# EAGLE design StearnsW (EAGLE 6.6.0)
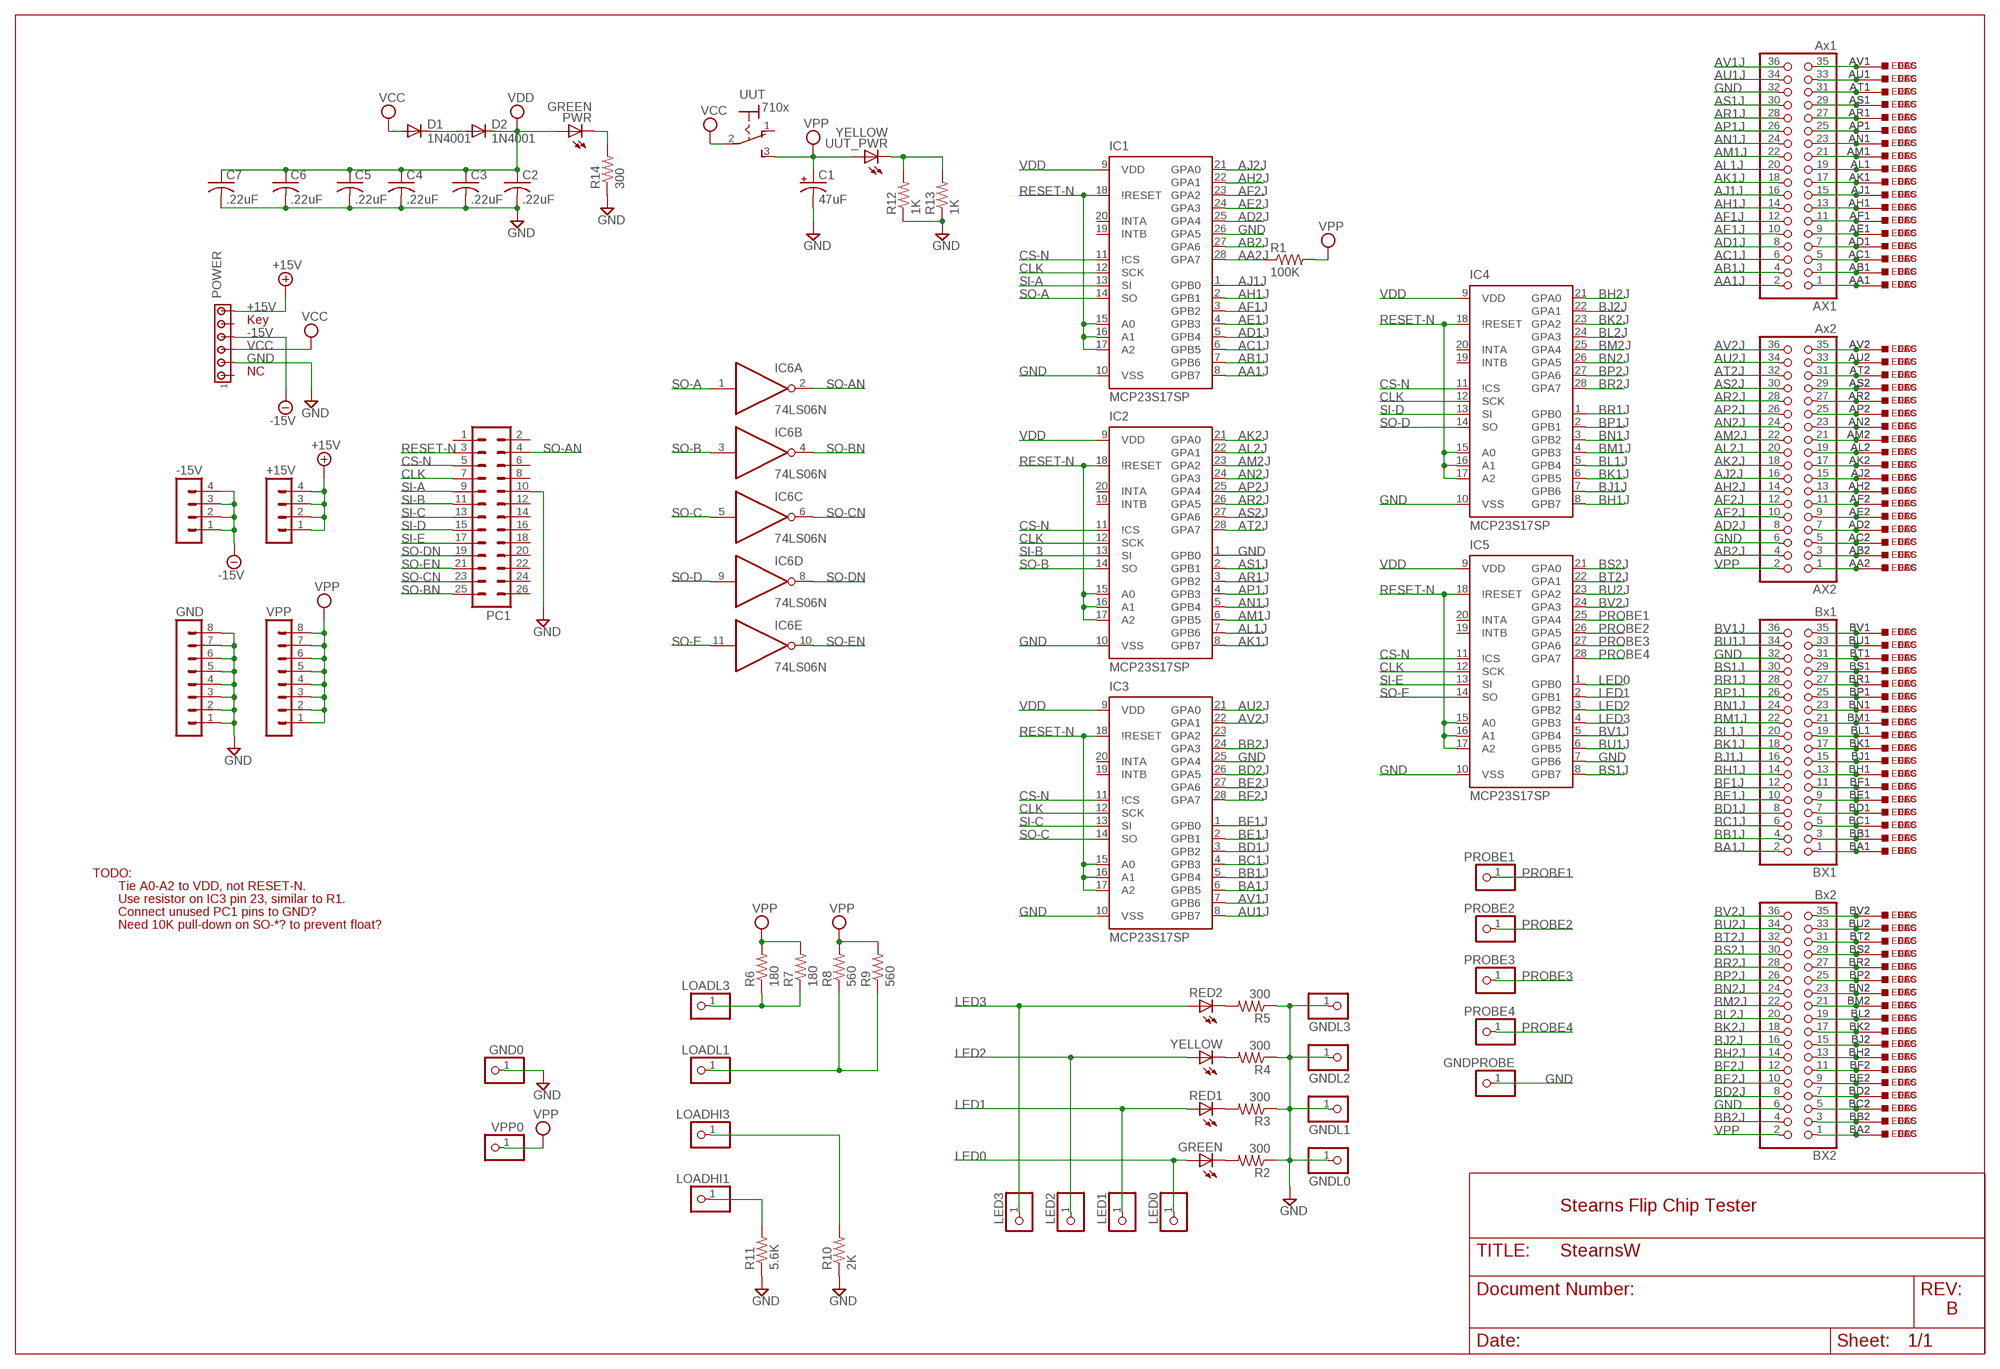
[diagram p0: schematic, sheet 1]

## Parts
+15V  MA04-1  [MA04-1]
-15V  MA04-1  [MA04-1]
AX1  Ax1  PINHD-2X18  [2X18]
AX2  Ax2  PINHD-2X18  [2X18]
BX1  Bx1  PINHD-2X18  [2X18]
BX2  Bx2  PINHD-2X18  [2X18]
C1  47uF  CPOL-USE5-8.5  [E5-8,5]
C2  .22uF  C-US050-025X075  [C050-025X075]
C3  .22uF  C-US050-025X075  [C050-025X075]
C4  .22uF  C-US050-025X075  [C050-025X075]
C5  .22uF  C-US050-025X075  [C050-025X075]
C6  .22uF  C-US050-025X075  [C050-025X075]
C7  .22uF  C-US050-025X075  [C050-025X075]
D1  1N4001  1N4004  [DO41-10]
D2  1N4001  1N4004  [DO41-10]
DEC  W971  [H807-2]
ECS  W971ECS  [ECS2418-2]
EDAC  W971EDAC  [EDAC346-36-2]
GND  MA08-1  [MA08-1]
GND0  PINHD-1X1  [1X01]
GNDL0  PINHD-1X1  [1X01]
GNDL1  PINHD-1X1  [1X01]
GNDL2  PINHD-1X1  [1X01]
GNDL3  PINHD-1X1  [1X01]
GNDPROBE  PINHD-1X1  [1X01]
GREEN  LED5MM  [LED5MM]
IC1  MCP23S17SP  [DIL28-3]
IC2  MCP23S17SP  [DIL28-3]
IC3  MCP23S17SP  [DIL28-3]
IC4  MCP23S17SP  [DIL28-3]
IC5  MCP23S17SP  [DIL28-3]
IC6  74LS06N  [DIL14]
LED0  PINHD-1X1  [1X01]
LED1  PINHD-1X1  [1X01]
LED2  PINHD-1X1  [1X01]
LED3  PINHD-1X1  [1X01]
LOADHI1  PINHD-1X1  [1X01]
LOADHI3  PINHD-1X1  [1X01]
LOADL1  PINHD-1X1  [1X01]
LOADL3  PINHD-1X1  [1X01]
PC1  MA13-2  [MA13-2]
POWER  MTA06-156  [1X6MTA]
PROBE1  PINHD-1X1  [1X01]
PROBE2  PINHD-1X1  [1X01]
PROBE3  PINHD-1X1  [1X01]
PROBE4  PINHD-1X1  [1X01]
PWR  GREEN  LED5MM  [LED5MM]
R1  100K  R-US_0207/10  [0207/10]
R2  300  R-US_0207/10  [0207/10]
R3  300  R-US_0207/10  [0207/10]
R4  300  R-US_0207/10  [0207/10]
R5  300  R-US_0207/10  [0207/10]
R6  180  R-US_0207/10  [0207/10]
R7  180  R-US_0207/10  [0207/10]
R8  560  R-US_0207/10  [0207/10]
R9  560  R-US_0207/10  [0207/10]
R10  2K  R-US_0207/10  [0207/10]
R11  5.6K  R-US_0207/10  [0207/10]
R12  1K  R-US_0207/10  [0207/10]
R13  1K  R-US_0207/10  [0207/10]
R14  300  R-US_0207/10  [0207/10]
RED1  LED5MM  [LED5MM]
RED2  LED5MM  [LED5MM]
UUT  710x  710X  [7109MD9V3]
UUT_PWR  YELLOW  LED5MM  [LED5MM]
VPP  MA08-1  [MA08-1]
VPP0  PINHD-1X1  [1X01]
YELLOW  LED5MM  [LED5MM]

## Nets
+15V [Supply]: +15V.1 +15V.2 +15V.3 +15V.4 POWER.6
-15V [Supply]: -15V.1 -15V.2 -15V.3 -15V.4 POWER.4
AA1J: AX1.2 IC1.8(GPB7)
AA2J: IC1.28(GPA7) R1.1
AB1J: AX1.4 IC1.7(GPB6)
AB2J: AX2.4 IC1.27(GPA6)
AC1J: AX1.6 IC1.6(GPB5)
AD1J: AX1.8 IC1.5(GPB4)
AD2J: AX2.8 IC1.25(GPA4)
AE1J: AX1.10 IC1.4(GPB3)
AE2J: AX2.10 IC1.24(GPA3)
AF1J: AX1.12 IC1.3(GPB2)
AF2J: AX2.12 IC1.23(GPA2)
AH1J: AX1.14 IC1.2(GPB1)
AH2J: AX2.14 IC1.22(GPA1)
AJ1J: AX1.16 IC1.1(GPB0)
AJ2J: AX2.16 IC1.21(GPA0)
AK1J: AX1.18 IC2.8(GPB7)
AK2J: AX2.18 IC2.21(GPA0)
AL1J: AX1.20 IC2.7(GPB6)
AL2J: AX2.20 IC2.22(GPA1)
AM1J: AX1.22 IC2.6(GPB5)
AM2J: AX2.22 IC2.23(GPA2)
AN1J: AX1.24 IC2.5(GPB4)
AN2J: AX2.24 IC2.24(GPA3)
AP1J: AX1.26 IC2.4(GPB3)
AP2J: AX2.26 IC2.25(GPA4)
AR1J: AX1.28 IC2.3(GPB2)
AR2J: AX2.28 IC2.26(GPA5)
AS1J: AX1.30 IC2.2(GPB1)
AS2J: AX2.30 IC2.27(GPA6)
AT2J: AX2.32 IC2.28(GPA7)
AU1J: AX1.34 IC3.8(GPB7)
AU2J: AX2.34 IC3.21(GPA0)
AV1J: AX1.36 IC3.7(GPB6)
AV2J: AX2.36 IC3.22(GPA1)
BA1J: BX1.2 IC3.6(GPB5)
BB1J: BX1.4 IC3.5(GPB4)
BB2J: BX2.4 IC3.24(GPA3)
BC1J: BX1.6 IC3.4(GPB3)
BD1J: BX1.8 IC3.3(GPB2)
BD2J: BX2.8 IC3.26(GPA5)
BE1J: BX1.10 IC3.2(GPB1)
BE2J: BX2.10 IC3.27(GPA6)
BF1J: BX1.12 IC3.1(GPB0)
BF2J: BX2.12 IC3.28(GPA7)
BH1J: BX1.14 IC4.8(GPB7)
BH2J: BX2.14 IC4.21(GPA0)
BJ1J: BX1.16 IC4.7(GPB6)
BJ2J: BX2.16 IC4.22(GPA1)
BK1J: BX1.18 IC4.6(GPB5)
BK2J: BX2.18 IC4.23(GPA2)
BL1J: BX1.20 IC4.5(GPB4)
BL2J: BX2.20 IC4.24(GPA3)
BM1J: BX1.22 IC4.4(GPB3)
BM2J: BX2.22 IC4.25(GPA4)
BN1J: BX1.24 IC4.3(GPB2)
BN2J: BX2.24 IC4.26(GPA5)
BP1J: BX1.26 IC4.2(GPB1)
BP2J: BX2.26 IC4.27(GPA6)
BR1J: BX1.28 IC4.1(GPB0)
BR2J: BX2.28 IC4.28(GPA7)
BS1J: BX1.30 IC5.8(GPB7)
BS2J: BX2.30 IC5.21(GPA0)
BT2J: BX2.32 IC5.22(GPA1)
BU1J: BX1.34 IC5.6(GPB5)
BU2J: BX2.34 IC5.23(GPA2)
BV1J: BX1.36 IC5.5(GPB4)
BV2J: BX2.36 IC5.24(GPA3)
CLK: IC1.12(SCK) IC2.12(SCK) IC3.12(SCK) IC4.12(SCK) IC5.12(SCK) PC1.7
CS-N: IC1.11(\!CS) IC2.11(\!CS) IC3.11(\!CS) IC4.11(\!CS) IC5.11(\!CS) PC1.5
GND [Supply]: AX1.32 AX2.6 BX1.32 BX2.6 C1.- C2.2 C3.2 C4.2 C5.2 C6.2 C7.2 GND0.1 GND.1 GND.2 GND.3 GND.4 GND.5 GND.6 GND.7 GND.8 GNDL0.1 GNDL1.1 GNDL2.1 GNDL3.1 GNDPROBE.1 IC1.10(VSS) IC1.26(GPA5) IC2.1(GPB0) IC2.10(VSS) IC3.10(VSS) IC3.25(GPA4) IC4.10(VSS) IC5.7(GPB6) IC5.10(VSS) PC1.10 POWER.2 R2.1 R3.1 R4.1 R5.1 R10.1 R11.1 R12.1 R13.1 R14.1
LED0: GREEN.A IC5.1(GPB0) LED0.1
LED1: IC5.2(GPB1) LED1.1 RED1.A
LED2: IC5.3(GPB2) LED2.1 YELLOW.A
LED3: IC5.4(GPB3) LED3.1 RED2.A
N$1: AX1.1 DEC.AA1 ECS.AA1 EDAC.AA1
N$2: AX1.35 DEC.AV1 ECS.AV1 EDAC.AV1
N$3: AX1.33 DEC.AU1 ECS.AU1 EDAC.AU1
N$4: AX1.31 DEC.AT1 ECS.AT1 EDAC.AT1
N$5: AX1.29 DEC.AS1 ECS.AS1 EDAC.AS1
N$6: AX1.27 DEC.AR1 ECS.AR1 EDAC.AR1
N$7: AX1.25 DEC.AP1 ECS.AP1 EDAC.AP1
N$8: AX1.23 DEC.AN1 ECS.AN1 EDAC.AN1
N$9: AX1.21 DEC.AM1 ECS.AM1 EDAC.AM1
N$10: AX1.19 DEC.AL1 ECS.AL1 EDAC.AL1
N$11: AX1.17 DEC.AK1 ECS.AK1 EDAC.AK1
N$12: AX1.15 DEC.AJ1 ECS.AJ1 EDAC.AJ1
N$13: AX1.13 DEC.AH1 ECS.AH1 EDAC.AH1
N$14: AX1.11 DEC.AF1 ECS.AF1 EDAC.AF1
N$15: AX1.9 DEC.AE1 ECS.AE1 EDAC.AE1
N$16: AX1.7 DEC.AD1 ECS.AD1 EDAC.AD1
N$17: AX1.5 DEC.AC1 ECS.AC1 EDAC.AC1
N$18: AX1.3 DEC.AB1 ECS.AB1 EDAC.AB1
N$19: AX2.1 DEC.AA2 ECS.AA2 EDAC.AA2
N$20: AX2.3 DEC.AB2 ECS.AB2 EDAC.AB2
N$21: AX2.5 DEC.AC2 ECS.AC2 EDAC.AC2
N$22: AX2.7 DEC.AD2 ECS.AD2 EDAC.AD2
N$23: AX2.9 DEC.AE2 ECS.AE2 EDAC.AE2
N$24: AX2.11 DEC.AF2 ECS.AF2 EDAC.AF2
N$25: AX2.13 DEC.AH2 ECS.AH2 EDAC.AH2
N$26: AX2.15 DEC.AJ2 ECS.AJ2 EDAC.AJ2
N$27: AX2.17 DEC.AK2 ECS.AK2 EDAC.AK2
N$28: AX2.19 DEC.AL2 ECS.AL2 EDAC.AL2
N$29: AX2.21 DEC.AM2 ECS.AM2 EDAC.AM2
N$30: AX2.23 DEC.AN2 ECS.AN2 EDAC.AN2
N$31: AX2.25 DEC.AP2 ECS.AP2 EDAC.AP2
N$32: AX2.27 DEC.AR2 ECS.AR2 EDAC.AR2
N$33: AX2.29 DEC.AS2 ECS.AS2 EDAC.AS2
N$34: AX2.31 DEC.AT2 ECS.AT2 EDAC.AT2
N$35: AX2.33 DEC.AU2 ECS.AU2 EDAC.AU2
N$36: AX2.35 DEC.AV2 ECS.AV2 EDAC.AV2
N$37: BX2.1 DEC.BA2 ECS.BA2 EDAC.BA2
N$38: BX2.3 DEC.BB2 ECS.BB2 EDAC.BB2
N$39: BX2.5 DEC.BC2 ECS.BC2 EDAC.BC2
N$40: BX2.7 DEC.BD2 ECS.BD2 EDAC.BD2
N$41: BX2.9 DEC.BE2 ECS.BE2 EDAC.BE2
N$42: BX2.11 DEC.BF2 ECS.BF2 EDAC.BF2
N$43: BX2.13 DEC.BH2 ECS.BH2 EDAC.BH2
N$44: BX2.15 DEC.BJ2 ECS.BJ2 EDAC.BJ2
N$45: BX2.17 DEC.BK2 ECS.BK2 EDAC.BK2
N$46: BX2.19 DEC.BL2 ECS.BL2 EDAC.BL2
N$47: BX2.21 DEC.BM2 ECS.BM2 EDAC.BM2
N$48: BX2.23 DEC.BN2 ECS.BN2 EDAC.BN2
N$49: BX2.25 DEC.BP2 ECS.BP2 EDAC.BP2
N$50: BX2.27 DEC.BR2 ECS.BR2 EDAC.BR2
N$51: BX2.29 DEC.BS2 ECS.BS2 EDAC.BS2
N$52: BX2.31 DEC.BT2 ECS.BT2 EDAC.BT2
N$53: BX2.33 DEC.BU2 ECS.BU2 EDAC.BU2
N$54: BX2.35 DEC.BV2 ECS.BV2 EDAC.BV2
N$55: BX1.1 DEC.BA1 ECS.BA1 EDAC.BA1
N$56: BX1.3 DEC.BB1 ECS.BB1 EDAC.BB1
N$57: BX1.5 DEC.BC1 ECS.BC1 EDAC.BC1
N$58: BX1.7 DEC.BD1 ECS.BD1 EDAC.BD1
N$59: BX1.9 DEC.BE1 ECS.BE1 EDAC.BE1
N$60: BX1.11 DEC.BF1 ECS.BF1 EDAC.BF1
N$61: BX1.13 DEC.BH1 ECS.BH1 EDAC.BH1
N$62: BX1.15 DEC.BJ1 ECS.BJ1 EDAC.BJ1
N$63: BX1.17 DEC.BK1 ECS.BK1 EDAC.BK1
N$64: BX1.19 DEC.BL1 ECS.BL1 EDAC.BL1
N$65: BX1.21 DEC.BM1 ECS.BM1 EDAC.BM1
N$66: BX1.23 DEC.BN1 ECS.BN1 EDAC.BN1
N$67: BX1.25 DEC.BP1 ECS.BP1 EDAC.BP1
N$68: BX1.27 DEC.BR1 ECS.BR1 EDAC.BR1
N$69: BX1.29 DEC.BS1 ECS.BS1 EDAC.BS1
N$70: BX1.31 DEC.BT1 ECS.BT1 EDAC.BT1
N$71: BX1.33 DEC.BU1 ECS.BU1 EDAC.BU1
N$72: BX1.35 DEC.BV1 ECS.BV1 EDAC.BV1
N$73: GREEN.K(C) R2.2
N$74: R3.2 RED1.K(C)
N$75: R4.2 YELLOW.K(C)
N$76: R5.2 RED2.K(C)
N$77: LOADL3.1 R6.1 R7.1
N$78: LOADL1.1 R8.1 R9.1
N$79: LOADHI1.1 R11.2
N$80: LOADHI3.1 R10.2
N$81: D1.C D2.A
N$82: R12.2 R13.2 UUT_PWR.K(C)
N$83: PWR.K(C) R14.2
PROBE1: IC5.25(GPA4) PROBE1.1
PROBE2: IC5.26(GPA5) PROBE2.1
PROBE3: IC5.27(GPA6) PROBE3.1
PROBE4: IC5.28(GPA7) PROBE4.1
RESET-N: IC1.15(A0) IC1.16(A1) IC1.17(A2) IC1.18(\!RESET) IC2.15(A0) IC2.16(A1) IC2.17(A2) IC2.18(\!RESET) IC3.15(A0) IC3.16(A1) IC3.17(A2) IC3.18(\!RESET) IC4.15(A0) IC4.16(A1) IC4.17(A2) IC4.18(\!RESET) IC5.15(A0) IC5.16(A1) IC5.17(A2) IC5.18(\!RESET) PC1.3
SI-A: IC1.13(SI) PC1.9
SI-B: IC2.13(SI) PC1.11
SI-C: IC3.13(SI) PC1.13
SI-D: IC4.13(SI) PC1.15
SI-E: IC5.13(SI) PC1.17
SO-A: IC1.14(SO) IC6.1(A:I)
SO-AN: IC6.2(A:O) PC1.4
SO-B: IC2.14(SO) IC6.3(B:I)
SO-BN: IC6.4(B:O) PC1.25
SO-C: IC3.14(SO) IC6.5(C:I)
SO-CN: IC6.6(C:O) PC1.23
SO-D: IC4.14(SO) IC6.9(D:I)
SO-DN: IC6.8(D:O) PC1.19
SO-E: IC5.14(SO) IC6.11(E:I)
SO-EN: IC6.10(E:O) PC1.21
VCC [Supply]: D1.A POWER.3 UUT.2(P)
VDD [Supply]: C2.1 C3.1 C4.1 C5.1 C6.1 C7.1 D2.C IC1.9(VDD) IC2.9(VDD) IC3.9(VDD) IC4.9(VDD) IC5.9(VDD) PWR.A
VPP [Supply]: AX2.2 BX2.2 C1.+ R1.2 R6.2 R7.2 R8.2 R9.2 UUT.3(S) UUT_PWR.A VPP0.1 VPP.1 VPP.2 VPP.3 VPP.4 VPP.5 VPP.6 VPP.7 VPP.8
Unconnected: IC1.19(INTB) IC1.20(INTA) IC2.19(INTB) IC2.20(INTA) IC3.19(INTB) IC3.20(INTA) IC3.23(GPA2) IC4.19(INTB) IC4.20(INTA) IC5.19(INTB) IC5.20(INTA) IC6.12(F:O) IC6.13(F:I) PC1.1 PC1.2 PC1.6 PC1.8 PC1.12 PC1.14 PC1.16 PC1.18 PC1.20 PC1.22 PC1.24 PC1.26 POWER.1 POWER.5 UUT.1(O)

## Notes on the sheet
- Key
- NC
- TODO:
- Tie A0-A2 to VDD, not RESET-N.
- Use resistor on IC3 pin 23, similar to R1.
- Connect unused PC1 pins to GND?
- Need 10K pull-down on SO-*? to prevent float?
- Stearns Flip Chip Tester
- B

## Power pins joined to a net without a drawn wire
GND: IC6.7(P:GND) UUT.NC@1(GND) UUT.NC@2(GND) UUT.NC@3(GND) UUT.NC@4(GND) UUT.NC@5(GND) UUT.NC@6(GND) UUT.NC@7(GND) UUT.NC@8(GND)
VCC: IC6.14(P:VCC)

## Library data of the parts
+15V -15V = con-lstb:MA04-1: PIN HEADER; OC_FARNELL: unknown; OC_NEWARK: unknown
AX1 AX2 BX1 BX2 = pinhead:PINHD-2X18: PIN HEADER
C1 = rcl:CPOL-US: POLARIZED CAPACITOR, American symbol
C2-C7 = rcl:C-US: CAPACITOR, American symbol
D1 D2 = diode:1N4004: DIODE general purpose rectifier, 1 A
DEC ECS EDAC = dec-m:W971: Double sided Double Height Connector, 72 pins
GND VPP = con-lstb:MA08-1: PIN HEADER; OC_FARNELL: unknown; OC_NEWARK: unknown
GND0 GNDL0 GNDL1-GNDL3 GNDPROBE LED0 LED1-LED3 LOADHI1 LOADHI3 LOADL1 LOADL3 PROBE1-PROBE4 VPP0 = pinhead:PINHD-1X1: PIN HEADER
GREEN PWR RED1 RED2 UUT_PWR YELLOW = led:LED: LED OSRAM: - CHIPLED LG R971, LG N971, LY N971, LG Q971, LY Q971, LO R971, LY R971 LH N974, LH R974 LS Q976, LO Q976, LY Q976 LO Q996 - Hyper CHIPLED LW Q18S LB Q993, LB Q99A, LB R99A - SideLED LS A670, LO A670, LY A670, LG A670, LP A670 LB A673, LV A673, LT A673, LW A673 LH A674 LY A675 LS A676, LA A676, LO A676, LY A676, LW A676 LS A679, LY A679, LG A679 - Hyper Micro SIDELED® LS Y876, LA Y876, LO Y876, LY Y876 LT Y87S - SmartLED LW L88C, LW L88S LB L89C, LB L89S, LG L890 LS L89K, LO L89K, LY L89K LS L896, LA L896, LO L896, LY L896 - TOPLED LS T670, LO T670, LY T670, LG T670, LP T670 LSG T670, LSP T670, LSY T670, LOP T670, LYG T670 LG T671, LOG T671, LSG T671 LB T673, LV T673, LT T673, LW T673 LH T674 LS T676, LA T676, LO T676, LY T676, LB T676, LH T676, LSB T676, LW T676 LB T67C, LV T67C, LT T67C, LS T67K, LO T67K, LY T67K, LW E67C LS E67B, LA E67B, LO E67B, LY E67B, LB E67C, LV E67C, LT E67C LW T67C LS T679, LY T679, LG T679 LS T770, LO T770, LY T770, LG T770, LP T770 LB T773, LV T773, LT T773, LW T773 LH T774 LS E675, LA E675, LY E675, LS T675 LS T776, LA T776, LO T776, LY T776, LB T776 LHGB T686 LT T68C, LB T68C - Hyper Mini TOPLED® LB M676 - Mini TOPLED Santana® LG M470 LS M47K, LO M47K, LY M47K Source: http://www.osram.convergy.de LUXEON: - LUMILED® LXK2-PW12-R00, LXK2-PW12-S00, LXK2-PW14-U00, LXK2-PW14-V00 LXK2-PM12-R00, LXK2-PM12-S00, LXK2-PM14-U00 LXK2-PE12-Q00, LXK2-PE12-R00, LXK2-PE12-S00, LXK2-PE14-T00, LXK2-PE14-U00 LXK2-PB12-K00, LXK2-PB12-L00, LXK2-PB12-M00, LXK2-PB14-N00, LXK2-PB14-P00, LXK2-PB14-Q00 LXK2-PR12-L00, LXK2-PR12-M00, LXK2-PR14-Q00, LXK2-PR14-R00 LXK2-PD12-Q00, LXK2-PD12-R00, LXK2-PD12-S00 LXK2-PH12-R00, LXK2-PH12-S00 LXK2-PL12-P00, LXK2-PL12-Q00, LXK2-PL12-R00 Source: www.luxeon.com KINGBRIGHT: KA-3528ASYC Source: www.kingbright.com
IC1-IC5 = MCP23S17:MCP23S17: http://ww1.microchip.com/downloads/en/DeviceDoc/21952a.pdf Source: http://ww1.microchip.com/downloads/en/DeviceDoc/21952a.pdf
IC6 = 74xx-us:74*06: Hex INVERTER, open collector high-voltage output
PC1 = con-lstb:MA13-2: PIN HEADER; OC_FARNELL: unknown; OC_NEWARK: unknown
POWER = con-amp:MTA06-156: AMP connector
R1-R14 = rcl:R-US_: RESISTOR, American symbol
UUT = dec-con:710X: 710x with optional V2 or V3 mounting bracket.

## Net classes
1 Supply: width 0.813 mm

## Board
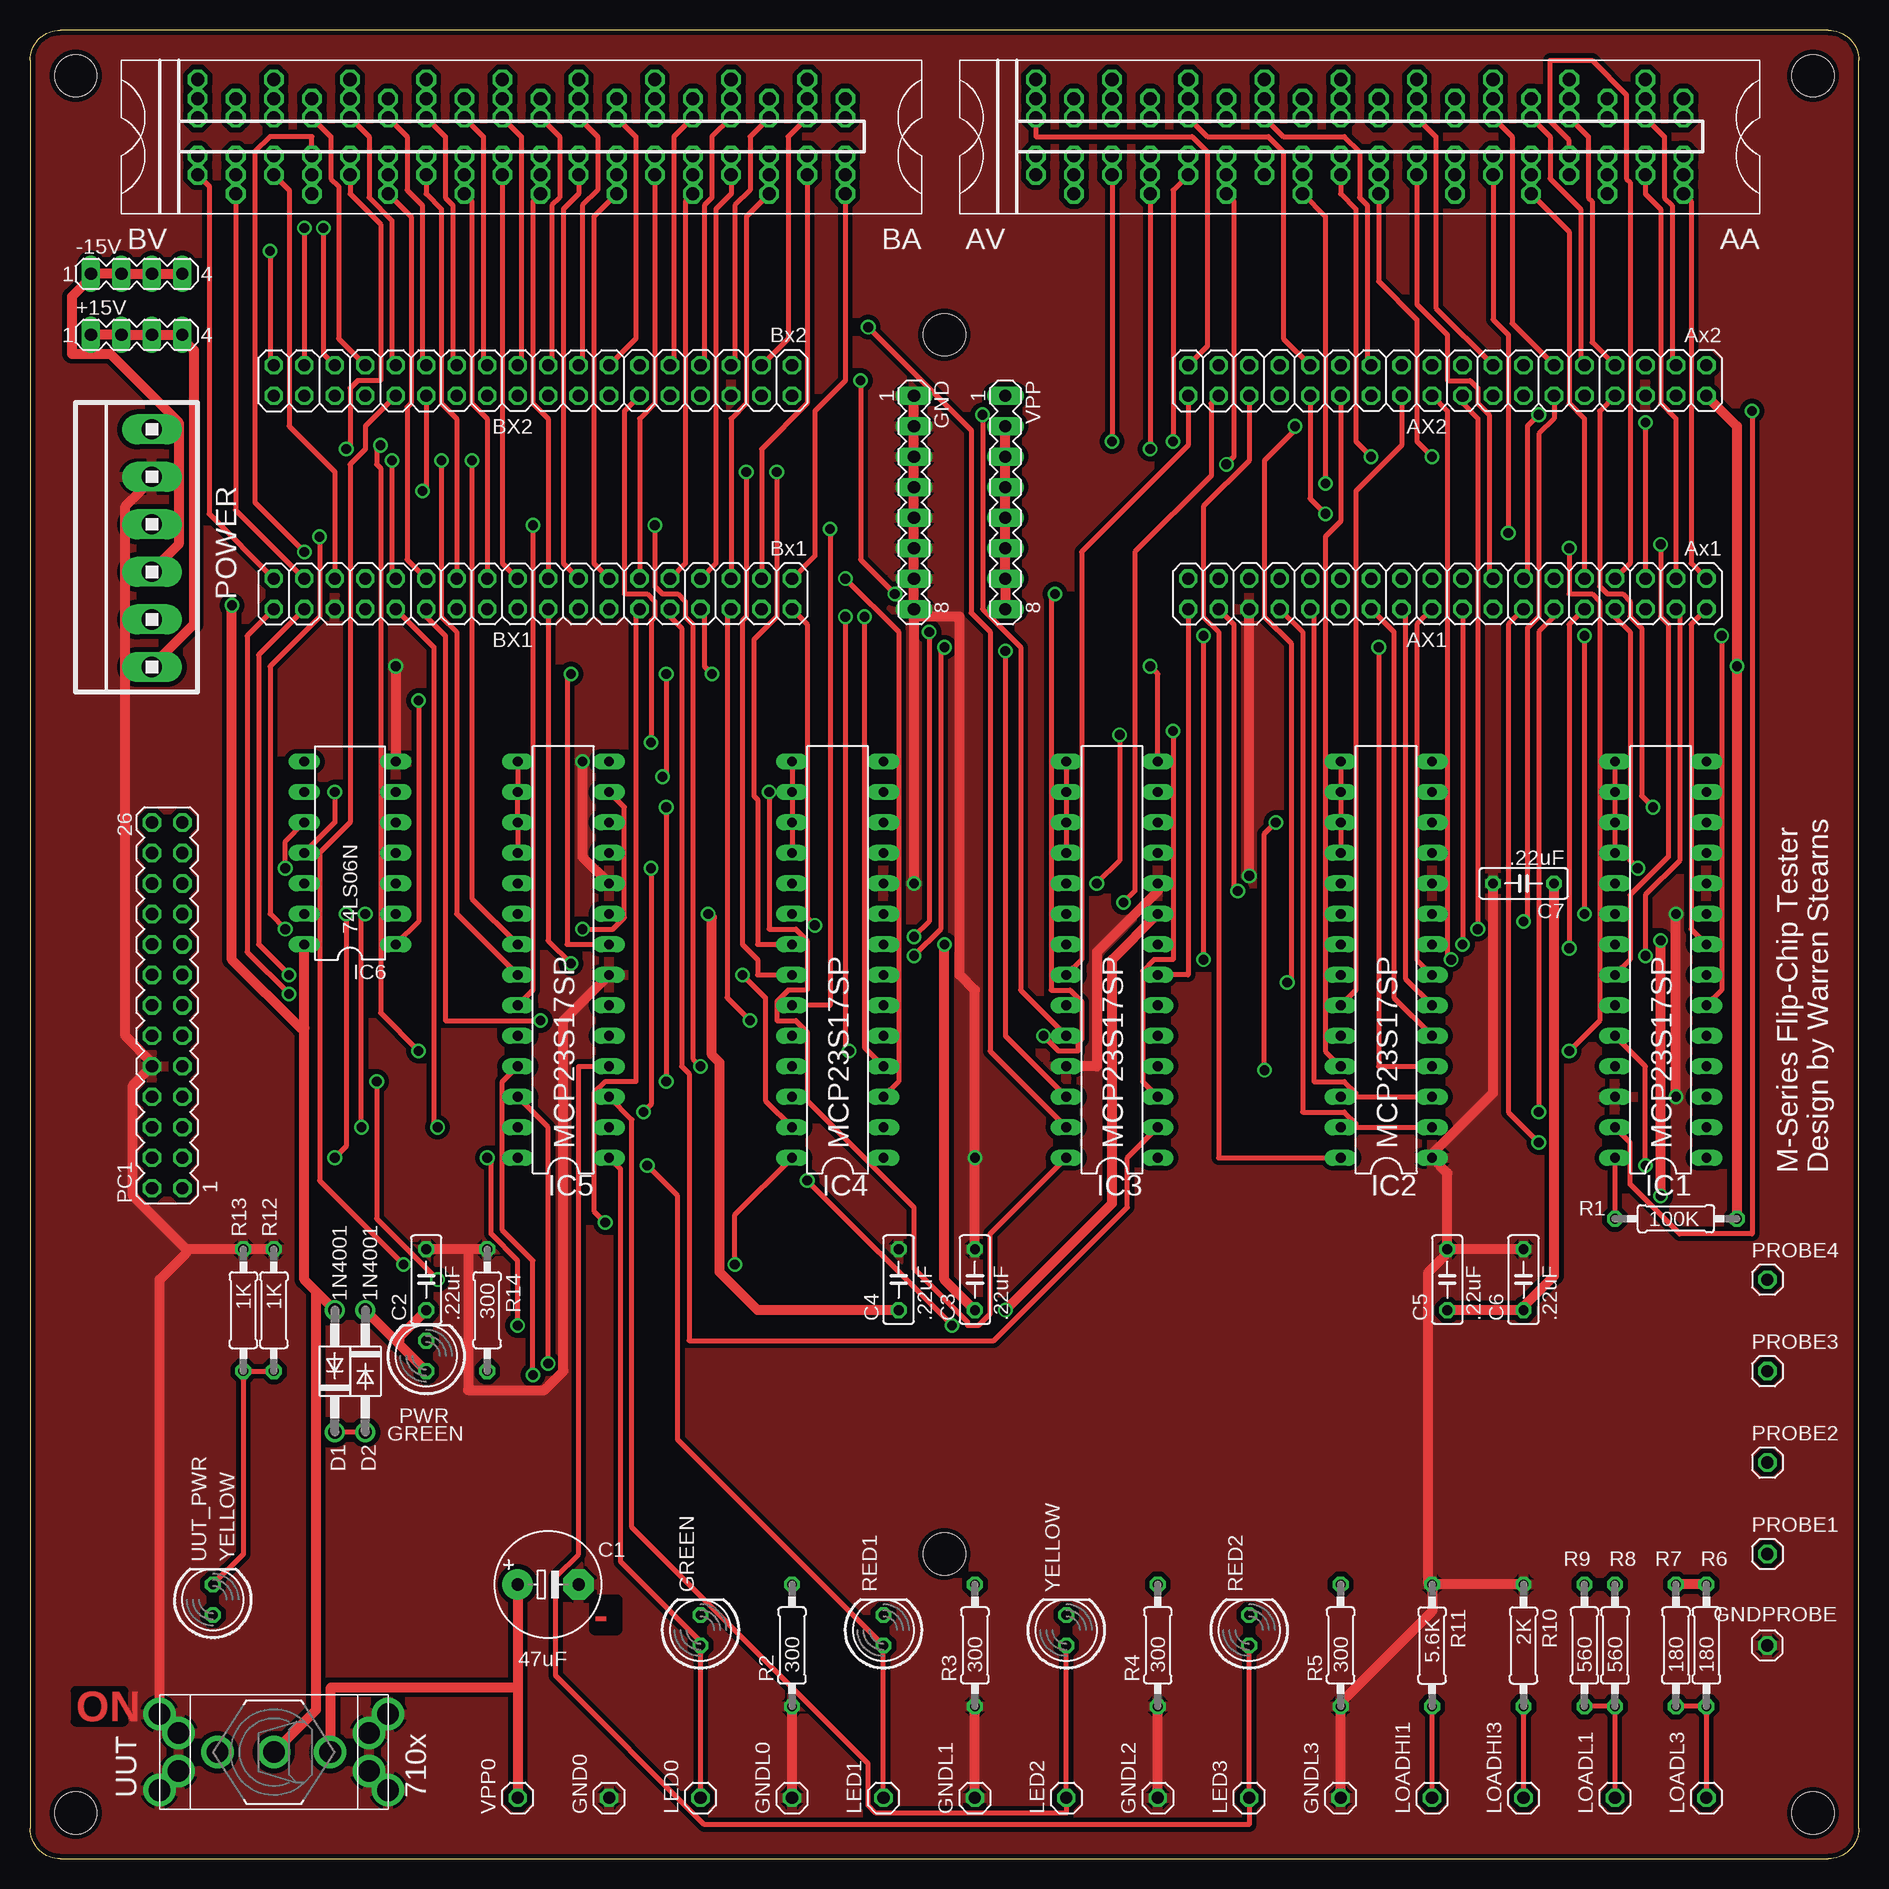
[diagram p1: board, top side]
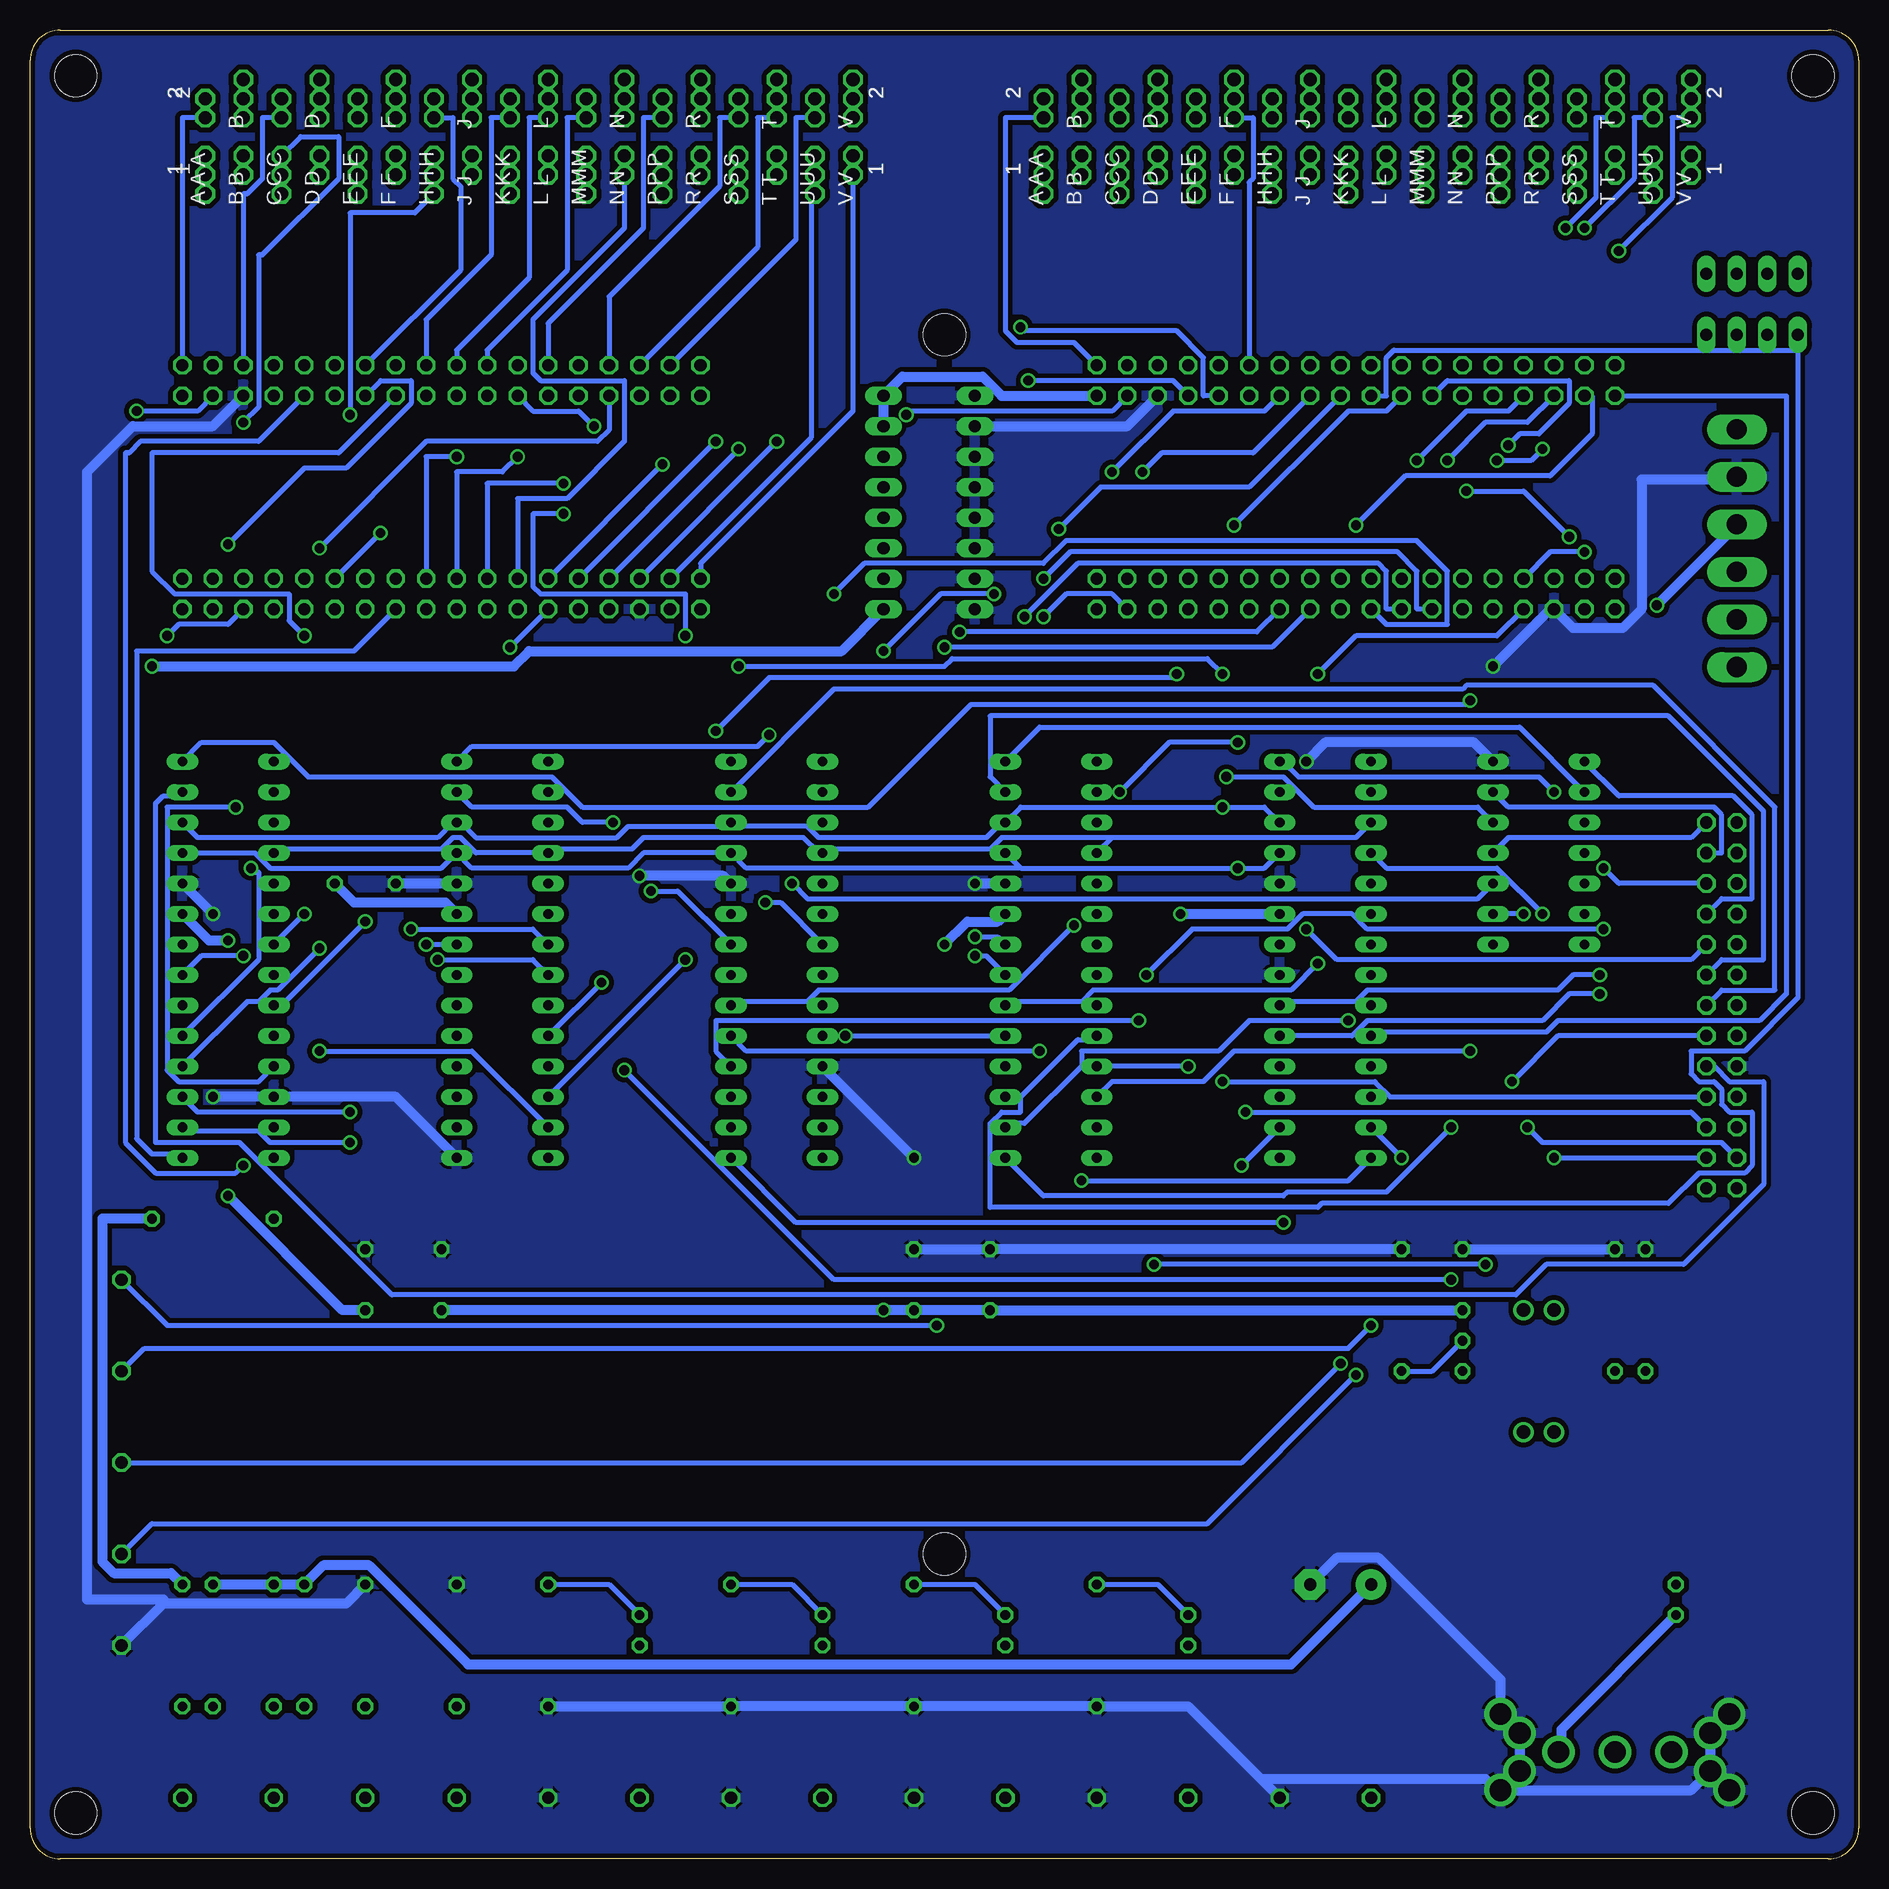
[diagram p2: board, bottom side, seen from below]

Size 152.4 x 152.4 mm. Coordinates in mm from the lower left corner, seen from the top.
Outline: 149.86,152.4 2.54,152.4 arc90 0,149.86 0,2.54 arc90 2.54,0 149.86,0 arc90 152.4,2.54 152.4,149.86 arc90 149.86,152.4
Copper layers (1+16): Top 0.035mm / dielectric 1.5mm / Bottom 0.035mm
Design rules "16mils *": minimum track width 16mil, minimum drill 32mil, track to track 15mil, track to pad 10mil, pad to pad 10mil, via to via 10mil, smd to smd 10mil, copper to edge 13mil, drill to drill 10mil, minimum pad ring 10mil, minimum via ring 8mil, stop-mask expansion 0mil, vias tented up to drill 0mil, thermal gap 10mil
Holes 3.51 mm at 148.59,148.59 3.81,148.59 3.81,3.81 148.59,3.81 76.2,127 76.2,25.4

### Footprints (pad centres in the part's own frame; a part is rotated, then mirrored left to right if it is on the bottom)
MA04-1 = drill 1.016 long: 1 -3.81,0; 2 -1.27,0; 3 1.27,0; 4 3.81,0
2X18 = drill 1.016 octagon: 1 -21.59,-1.27; 2 -21.59,1.27; 3 -19.05,-1.27; 4 -19.05,1.27; 5 -16.51,-1.27; 6 -16.51,1.27; 7 -13.97,-1.27; 8 -13.97,1.27; 9 -11.43,-1.27; 10 -11.43,1.27; 11 -8.89,-1.27; 12 -8.89,1.27; 13 -6.35,-1.27; 14 -6.35,1.27; 15 -3.81,-1.27; 16 -3.81,1.27; 17 -1.27,-1.27; 18 -1.27,1.27; 19 1.27,-1.27; 20 1.27,1.27; 21 3.81,-1.27; 22 3.81,1.27; 23 6.35,-1.27; 24 6.35,1.27; 25 8.89,-1.27; 26 8.89,1.27; 27 11.43,-1.27; 28 11.43,1.27; 29 13.97,-1.27; 30 13.97,1.27; 31 16.51,-1.27; 32 16.51,1.27; 33 19.05,-1.27; 34 19.05,1.27; 35 21.59,-1.27; 36 21.59,1.27
E5-8,5 = drill 1.016 pad 2.54: + -2.54,0 | drill 1.016 pad 2.54 octagon: - 2.54,0
C050-025X075 = drill 0.813 octagon: 1 -2.54,0; 2 2.54,0
DO41-10 = drill 1.118: A 5.08,0; C -5.08,0
H807-2 = drill 1.092 octagon: AA1 4.763,60.325; AA2 -1.587,60.325; AB1 1.587,57.15; AB2 -4.763,57.15; AC1 4.763,53.975; AC2 -1.587,53.975; AD1 1.587,50.8; AD2 -4.763,50.8; AE1 4.763,47.625; AE2 -1.587,47.625; AF1 1.587,44.45; AF2 -4.763,44.45; AH1 4.763,41.275; AH2 -1.587,41.275; AJ1 1.587,38.1; AJ2 -4.763,38.1; AK1 4.763,34.925; AK2 -1.587,34.925; AL1 1.587,31.75; AL2 -4.763,31.75; AM1 4.763,28.575; AM2 -1.587,28.575; AN1 1.587,25.4; AN2 -4.763,25.4; AP1 4.763,22.225; AP2 -1.587,22.225; AR1 1.587,19.05; AR2 -4.763,19.05; AS1 4.763,15.875; AS2 -1.587,15.875; AT1 1.587,12.7; AT2 -4.763,12.7; AU1 4.763,9.525; AU2 -1.587,9.525; AV1 1.587,6.35; AV2 -4.763,6.35; BA1 4.763,-9.525; BA2 -1.587,-9.525; BB1 1.587,-12.7; BB2 -4.763,-12.7; BC1 4.763,-15.875; BC2 -1.587,-15.875; BD1 1.587,-19.05; BD2 -4.763,-19.05; BE1 4.763,-22.225; BE2 -1.587,-22.225; BF1 1.587,-25.4; BF2 -4.763,-25.4; BH1 4.763,-28.575; BH2 -1.587,-28.575; BJ1 1.587,-31.75; BJ2 -4.763,-31.75; BK1 4.763,-34.925; BK2 -1.587,-34.925; BL1 1.587,-38.1; BL2 -4.763,-38.1; BM1 4.763,-41.275; BM2 -1.587,-41.275; BN1 1.587,-44.45; BN2 -4.763,-44.45; BP1 4.763,-47.625; BP2 -1.587,-47.625; BR1 1.587,-50.8; BR2 -4.763,-50.8; BS1 4.763,-53.975; BS2 -1.587,-53.975; BT1 1.587,-57.15; BT2 -4.763,-57.15; BU1 4.763,-60.325; BU2 -1.587,-60.325; BV1 1.587,-63.5; BV2 -4.763,-63.5
ECS2418-2 = drill 1.092 octagon: AA1 1.587,60.325; AA2 -1.587,60.325; AB1 1.587,57.15; AB2 -1.587,57.15; AC1 1.587,53.975; AC2 -1.587,53.975; AD1 1.587,50.8; AD2 -1.587,50.8; AE1 1.587,47.625; AE2 -1.587,47.625; AF1 1.587,44.45; AF2 -1.587,44.45; AH1 1.587,41.275; AH2 -1.587,41.275; AJ1 1.587,38.1; AJ2 -1.587,38.1; AK1 1.587,34.925; AK2 -1.587,34.925; AL1 1.587,31.75; AL2 -1.587,31.75; AM1 1.587,28.575; AM2 -1.587,28.575; AN1 1.587,25.4; AN2 -1.587,25.4; AP1 1.587,22.225; AP2 -1.587,22.225; AR1 1.587,19.05; AR2 -1.587,19.05; AS1 1.587,15.875; AS2 -1.587,15.875; AT1 1.587,12.7; AT2 -1.587,12.7; AU1 1.587,9.525; AU2 -1.587,9.525; AV1 1.587,6.35; AV2 -1.587,6.35; BA1 1.587,-9.525; BA2 -1.587,-9.525; BB1 1.587,-12.7; BB2 -1.587,-12.7; BC1 1.587,-15.875; BC2 -1.587,-15.875; BD1 1.587,-19.05; BD2 -1.587,-19.05; BE1 1.587,-22.225; BE2 -1.587,-22.225; BF1 1.587,-25.4; BF2 -1.587,-25.4; BH1 1.587,-28.575; BH2 -1.587,-28.575; BJ1 1.587,-31.75; BJ2 -1.587,-31.75; BK1 1.587,-34.925; BK2 -1.587,-34.925; BL1 1.587,-38.1; BL2 -1.587,-38.1; BM1 1.587,-41.275; BM2 -1.587,-41.275; BN1 1.587,-44.45; BN2 -1.587,-44.45; BP1 1.587,-47.625; BP2 -1.587,-47.625; BR1 1.587,-50.8; BR2 -1.587,-50.8; BS1 1.587,-53.975; BS2 -1.587,-53.975; BT1 1.587,-57.15; BT2 -1.587,-57.15; BU1 1.587,-60.325; BU2 -1.587,-60.325; BV1 1.587,-63.5; BV2 -1.587,-63.5
EDAC346-36-2 = drill 1.092 octagon: AA1 3.175,60.325; AA2 -3.175,60.325; AB1 3.175,57.15; AB2 -3.175,57.15; AC1 3.175,53.975; AC2 -3.175,53.975; AD1 3.175,50.8; AD2 -3.175,50.8; AE1 3.175,47.625; AE2 -3.175,47.625; AF1 3.175,44.45; AF2 -3.175,44.45; AH1 3.175,41.275; AH2 -3.175,41.275; AJ1 3.175,38.1; AJ2 -3.175,38.1; AK1 3.175,34.925; AK2 -3.175,34.925; AL1 3.175,31.75; AL2 -3.175,31.75; AM1 3.175,28.575; AM2 -3.175,28.575; AN1 3.175,25.4; AN2 -3.175,25.4; AP1 3.175,22.225; AP2 -3.175,22.225; AR1 3.175,19.05; AR2 -3.175,19.05; AS1 3.175,15.875; AS2 -3.175,15.875; AT1 3.175,12.7; AT2 -3.175,12.7; AU1 3.175,9.525; AU2 -3.175,9.525; AV1 3.175,6.35; AV2 -3.175,6.35; BA1 3.175,-9.525; BA2 -3.175,-9.525; BB1 3.175,-12.7; BB2 -3.175,-12.7; BC1 3.175,-15.875; BC2 -3.175,-15.875; BD1 3.175,-19.05; BD2 -3.175,-19.05; BE1 3.175,-22.225; BE2 -3.175,-22.225; BF1 3.175,-25.4; BF2 -3.175,-25.4; BH1 3.175,-28.575; BH2 -3.175,-28.575; BJ1 3.175,-31.75; BJ2 -3.175,-31.75; BK1 3.175,-34.925; BK2 -3.175,-34.925; BL1 3.175,-38.1; BL2 -3.175,-38.1; BM1 3.175,-41.275; BM2 -3.175,-41.275; BN1 3.175,-44.45; BN2 -3.175,-44.45; BP1 3.175,-47.625; BP2 -3.175,-47.625; BR1 3.175,-50.8; BR2 -3.175,-50.8; BS1 3.175,-53.975; BS2 -3.175,-53.975; BT1 3.175,-57.15; BT2 -3.175,-57.15; BU1 3.175,-60.325; BU2 -3.175,-60.325; BV1 3.175,-63.5; BV2 -3.175,-63.5
MA08-1 = drill 1.016 long: 1 -8.89,0; 2 -6.35,0; 3 -3.81,0; 4 -1.27,0; 5 1.27,0; 6 3.81,0; 7 6.35,0; 8 8.89,0
1X01 = drill 1.016 octagon: 1 0,0
LED5MM = drill 0.813 octagon: A -1.27,0; K 1.27,0
DIL28-3 = drill 0.813 long: 1 -16.51,-3.81; 2 -13.97,-3.81; 3 -11.43,-3.81; 4 -8.89,-3.81; 5 -6.35,-3.81; 6 -3.81,-3.81; 7 -1.27,-3.81; 8 1.27,-3.81; 9 3.81,-3.81; 10 6.35,-3.81; 11 8.89,-3.81; 12 11.43,-3.81; 13 13.97,-3.81; 14 16.51,-3.81; 15 16.51,3.81; 16 13.97,3.81; 17 11.43,3.81; 18 8.89,3.81; 19 6.35,3.81; 20 3.81,3.81; 21 1.27,3.81; 22 -1.27,3.81; 23 -3.81,3.81; 24 -6.35,3.81; 25 -8.89,3.81; 26 -11.43,3.81; 27 -13.97,3.81; 28 -16.51,3.81
DIL14 = drill 0.813 long: 1 -7.62,-3.81; 2 -5.08,-3.81; 3 -2.54,-3.81; 4 0,-3.81; 5 2.54,-3.81; 6 5.08,-3.81; 7 7.62,-3.81; 8 7.62,3.81; 9 5.08,3.81; 10 2.54,3.81; 11 0,3.81; 12 -2.54,3.81; 13 -5.08,3.81; 14 -7.62,3.81
MA13-2 = drill 1.016 octagon: 1 -15.24,-1.27; 2 -15.24,1.27; 3 -12.7,-1.27; 4 -12.7,1.27; 5 -10.16,-1.27; 6 -10.16,1.27; 7 -7.62,-1.27; 8 -7.62,1.27; 9 -5.08,-1.27; 10 -5.08,1.27; 11 -2.54,-1.27; 12 -2.54,1.27; 13 0,-1.27; 14 0,1.27; 15 2.54,-1.27; 16 2.54,1.27; 17 5.08,-1.27; 18 5.08,1.27; 19 7.62,-1.27; 20 7.62,1.27; 21 10.16,-1.27; 22 10.16,1.27; 23 12.7,-1.27; 24 12.7,1.27; 25 15.24,-1.27; 26 15.24,1.27
1X6MTA = drill 1.676 long: 1 9.906,0; 2 5.944,0; 3 1.981,0; 4 -1.981,0; 5 -5.944,0; 6 -9.906,0
0207/10 = drill 0.813 octagon: 1 -5.08,0; 2 5.08,0
7109MD9V3 = drill 1.803: 1 0,4.699; 2 0,0; 3 0,-4.699; NC@1 -3.175,9.525; NC@2 -1.587,7.938; NC@3 3.175,9.525; NC@4 1.587,7.938; NC@5 -3.175,-9.525; NC@6 -1.587,-7.938; NC@7 1.587,-7.938; NC@8 3.175,-9.525

### Placement (x,y rotation side)
+15V  8.89,127 0 top
-15V  8.89,132.08 0 top
AX1  118.11,105.41 180 top
AX2  118.11,123.19 180 top
BX1  41.91,105.41 180 top
BX2  41.91,123.19 180 top
C1  43.18,22.86 0 top
C2  33.02,48.26 90 top
C3  78.74,48.26 90 top
C4  72.39,48.26 90 top
C5  118.11,48.26 90 top
C6  124.46,48.26 90 top
C7  124.46,81.28 180 top
D1  25.4,40.64 90 top
D2  27.94,40.64 270 top
DEC  77.47,143.51 270 top
ECS  77.47,143.51 270 top
EDAC  77.47,143.51 270 top
GND  73.66,113.03 270 top
GND0  48.26,5.08 90 top
GNDL0  63.5,5.08 90 top
GNDL1  78.74,5.08 90 top
GNDL2  93.98,5.08 90 top
GNDL3  109.22,5.08 90 top
GNDPROBE  144.78,17.78 180 top
GREEN  55.88,19.05 90 top
IC1  135.89,74.93 90 top
IC2  113.03,74.93 90 top
IC3  90.17,74.93 90 top
IC4  67.31,74.93 90 top
IC5  44.45,74.93 90 top
IC6  26.67,83.82 90 top
LED0  55.88,5.08 90 top
LED1  71.12,5.08 90 top
LED2  86.36,5.08 90 top
LED3  101.6,5.08 90 top
LOADHI1  116.84,5.08 90 top
LOADHI3  124.46,5.08 90 top
LOADL1  132.08,5.08 90 top
LOADL3  139.7,5.08 90 top
PC1  11.43,71.12 90 top
POWER  10.16,109.22 90 top
PROBE1  144.78,25.4 0 top
PROBE2  144.78,33.02 0 top
PROBE3  144.78,40.64 0 top
PROBE4  144.78,48.26 0 top
PWR  33.02,41.91 90 top
R1  137.16,53.34 0 top
R2  63.5,17.78 90 top
R3  78.74,17.78 90 top
R4  93.98,17.78 90 top
R5  109.22,17.78 90 top
R6  139.7,17.78 90 top
R7  137.16,17.78 90 top
R8  132.08,17.78 90 top
R9  129.54,17.78 90 top
R10  124.46,17.78 270 top
R11  116.84,17.78 270 top
R12  20.32,45.72 270 top
R13  17.78,45.72 270 top
R14  38.1,45.72 270 top
RED1  71.12,19.05 90 top
RED2  101.6,19.05 90 top
UUT  20.32,8.89 90 top
UUT_PWR  15.24,21.59 90 top
VPP  81.28,113.03 270 top
VPP0  40.64,5.08 90 top
YELLOW  86.36,19.05 90 top

### Tracks (layer width: path | path; a pad name or v marks a point on that pad's centre or on a via)
+15V
  Top 0.813: +15V.1 +15V.2 +15V.3 +15V.4 12.7,126.68 13.65,125.73 13.65,102.87 10.16,99.38 POWER.6
-15V
  Top 0.813: -15V.4 -15V.3 -15V.2 -15V.1 5.08,131.76 3.49,130.18 3.49,125.41 6.67,125.41 12.38,119.7 12.38,109.54 10.16,107.31 POWER.4
AA1J
  Top 0.406: IC1.8 138.43,77.47 138.43,102.87 AX1.2
AA2J
  Top 0.406: IC1.28 R1.1
AB1J  (via drill 0.81)
  Top 0.406: v134.62,75.25 134.62,80.33 137.48,83.19 137.48,103.82 AX1.4
  Bottom 0.406: IC1.7 138.11,75.25 v134.62,75.25
AB2J  (via drill 0.81)
  Top 0.406: IC1.27 133.35,59.69 133.35,56.2 137.48,52.07 143.51,52.07 v143.51,120.65
  Bottom 0.406: v143.51,120.65 138.43,120.65 AX2.4
AC1J  (via drill 0.81)
  Top 0.406: IC1.6 140.97,72.39 v140.97,101.92
  Bottom 0.406: v140.97,101.92 140.02,102.87 135.89,102.87 AX1.6
AD1J  (via drill 0.81)
  Top 0.406: v133.99,82.55 133.35,83.19 133.35,102.23 132.08,103.5 AX1.8
  Bottom 0.406: IC1.5 133.35,74.93 133.35,82.23 133.67,82.23 v133.99,82.55
AD2J  (via drill 0.81)
  Top 0.406: v135.25,87.63 134.3,88.58 134.3,102.55 133.35,103.5 133.35,104.78 132.72,105.41 131.44,105.41 130.81,106.05 130.81,120.65 AX2.8
  Bottom 0.406: IC1.25 133.35,64.77 140.02,64.77 140.97,65.72 140.97,87.63 v135.25,87.63
AE1J  (via drill 0.81)
  Top 0.406: v128.27,75.88 128.27,102.87 AX1.10
  Bottom 0.406: IC1.4 134.3,71.44 133.35,71.44 132.4,72.39 131.76,72.39 v128.27,75.88
AE2J  (via drill 0.81)
  Top 0.406: IC1.24 134.62,66.04 v134.62,57.78
  Bottom 0.406: v134.62,57.78 135.25,57.15 141.92,57.15 144.46,59.69 144.46,117.16 144.15,117.16 143.19,118.11 133.35,118.11 AX2.10
AF1J  (via drill 0.81)
  Top 0.406: v125.73,62.23 125.73,102.23 127,103.5 AX1.12
  Bottom 0.406: IC1.3 138.43,62.23 v125.73,62.23
AF2J  (via drill 0.81)
  Top 0.406: v124.46,78.11 124.78,78.42 124.78,102.55 125.73,103.5 125.73,118.75 127,120.02 AX2.12
  Bottom 0.406: IC1.23 131.76,71.44 131.13,71.44 v124.46,78.11
AH1J  (via drill 0.81)
  Top 0.406: v125.73,59.69 123.19,62.23 123.19,102.87 AX1.14
  Bottom 0.406: IC1.2 139.38,60.64 133.35,60.64 132.4,59.69 v125.73,59.69
AH2J  (via drill 0.81)
  Top 0.406: IC1.22 133.35,74.93 133.35,80.33 136.53,83.5 136.53,102.87 135.89,103.5 v135.89,109.54
  Bottom 0.406: v135.89,109.54 129.54,115.89 126.05,115.89 120.65,121.28 120.65,123.19 123.19,123.19 AX2.14
AJ1J
  Bottom 0.406: IC1.1 140.02,58.74 142.24,58.74 143.51,60.01 143.51,100.65 125.41,100.65 AX1.16
AJ2J  (via drill 0.81)
  Top 0.406: v129.54,101.92 v129.54,78.74
  Bottom 0.406: v129.54,78.74 IC1.21 | v129.54,101.92 130.81,103.19 130.81,105.41 140.34,105.41 142.24,107.31 142.24,117.16 126.68,117.16 AX2.16
AK1J  (via drill 0.81)
  Top 0.406: AX1.18 v119.38,76.2
  Bottom 0.406: v119.38,76.2 IC2.8
AK2J  (via drill 0.81)
  Top 0.406: v120.65,77.47 120.65,120.02 119.38,121.28 AX2.18
  Bottom 0.406: IC2.21 110.49,77.47 v120.65,77.47
AL1J
  Top 0.406: IC2.7 115.57,74.93 115.57,102.87 AX1.20
AL2J  (via drill 0.81)
  Top 0.406: v118.43,74.93 118.11,75.25 118.11,120.65 AX2.20
  Bottom 0.406: IC2.22 110.49,74.93 v118.43,74.93
AM1J
  Top 0.406: IC2.6 114.62,73.34 114.62,103.82 AX1.22
AM2J
  Top 0.406: IC2.23 110.49,72.39 110.49,113.98 114.3,117.79 AX2.22
AN1J
  Top 0.406: IC2.5 113.67,71.75 113.67,102.23 AX1.24
AN2J  (via drill 0.81)
  Top 0.406: v104.78,73.03 105.09,73.34 105.09,101.28 102.87,103.5 102.87,116.52 105.41,119.06 v105.41,119.38
  Bottom 0.406: v104.78,73.03 IC2.24 | v105.41,119.38 106.68,120.65 110.49,120.65 AX2.24
AP1J  (via drill 0.81)
  Top 0.406: IC2.4 112.39,66.04 v112.39,100.97
  Bottom 0.406: AX1.26 v112.39,100.97
AP2J
  Top 0.406: IC2.25 107.95,67.31 107.95,110.17 109.22,111.44 AX2.26
AR1J
  Top 0.406: IC2.3 110.49,63.5 110.49,63.82 109.54,64.77 107,64.77 107,103.82 AX1.28
AR2J  (via drill 0.81)
  Top 0.406: v97.79,101.92 v97.79,74.93 | v107.95,112.08 106.68,113.35 AX2.28
  Bottom 0.406: v97.79,74.93 IC2.26 | v97.79,101.92 97.79,105.41 109.86,105.41 110.49,106.05 110.49,112.08 v107.95,112.08
AS1J
  Top 0.406: IC2.2 110.49,60.96 110.49,61.28 109.54,62.23 106.05,62.23 106.05,102.23 AX1.30
AS2J  (via drill 0.81)
  Top 0.406: v128.27,67.31 130.81,69.85 130.81,104.78 130.18,105.41 128.27,105.41 v128.27,109.22
  Bottom 0.406: IC2.27 115.57,67.31 v128.27,67.31 | v128.27,109.22 119.38,118.11 105.09,118.11 104.14,119.06 AX2.30
AT2J
  Top 0.406: IC2.28 99.06,58.42 99.06,102.23 97.79,103.5 97.79,112.71 101.6,116.52 AX2.32
AU1J  (via drill 0.81)
  Top 0.406: v100.65,80.64 100.33,80.96 100.33,102.87 AX1.34
  Bottom 0.406: IC3.8 98.42,80.64 v100.65,80.64
AU2J  (via drill 0.81)
  Top 0.406: v91.12,79.69 92.08,80.64 92.08,108.9 98.42,115.25 98.42,121.28 AX2.34
  Bottom 0.406: IC3.21 89.85,79.69 v91.12,79.69
AV1J
  Top 0.406: IC3.7 96.52,73.66 AX1.36
AV2J
  Top 0.406: IC3.22 87.63,74.93 87.63,108.9 96.52,117.79 AX2.36
BA1J  (via drill 0.81)
  Top 0.406: v65.41,77.79 64.77,78.42 64.77,102.87 BX1.2
  Bottom 0.406: IC3.6 93.66,71.44 87.63,71.44 86.68,72.39 70.8,72.39 v65.41,77.79
BB1J  (via drill 0.81)
  Top 0.406: v68.26,67.31 67.94,67.63 v67.94,103.5
  Bottom 0.406: IC3.5 92.71,67.31 v68.26,67.31 | v67.94,103.5 66.04,105.41 62.23,105.41 BX1.4
BB2J  (via drill 0.81)
  Top 0.406: IC3.24 82.55,72.39 82.55,100.97 79.38,104.14 v79.38,120.33
  Bottom 0.406: v79.38,120.33 79.06,120.65 62.23,120.65 BX2.4
BC1J  (via drill 0.81)
  Top 0.406: v60.01,69.85 58.1,71.75 58.1,103.82 BX1.6
  Bottom 0.406: IC3.4 95.25,67.31 95.25,69.85 v60.01,69.85
BD1J  (via drill 0.81)
  Top 0.406: IC3.3 92.71,64.77 92.71,73.98 93.66,74.93 95.25,74.93 v95.25,93.98 | v56.83,98.74 56.2,99.38 56.2,103.82 BX1.8
  Bottom 0.406: v95.25,93.98 90.81,98.42 57.15,98.42 v56.83,98.74
BD2J  (via drill 0.81)
  Top 0.406: IC3.26 81.28,68.58 v81.28,100.65 | v72.07,105.41 69.22,108.27 v69.22,123.19
  Bottom 0.406: v81.28,100.65 76.52,105.41 v72.07,105.41 | v69.22,123.19 57.15,123.19 BX2.8
BE1J
  Top 0.406: IC3.2 91.44,58.42 91.44,54.29 80.33,43.18 54.93,43.18 54.93,65.41 54.29,66.04 54.29,102.55 53.34,103.5 BX1.10
BE2J  (via drill 0.81)
  Top 0.406: IC3.27 80.01,67.31 80.01,102.23 78.42,103.82 78.42,119.06 v69.85,127.64
  Bottom 0.406: v69.85,127.64 69.53,127.32 56.83,127.32 54.61,125.09 54.61,121.92 BX2.10
BF1J  (via drill 0.81)
  Top 0.406: v47.94,53.02 46.99,53.98 46.99,63.82 47.94,64.77 50.48,64.77 50.48,103.82 BX1.12
  Bottom 0.406: IC3.1 88.58,53.02 v47.94,53.02
BF2J  (via drill 0.81)
  Top 0.406: IC3.28 80.01,52.07 80.01,45.4 79.06,44.45 78.11,44.45 78.11,44.77 73.66,49.21 73.66,54.29 64.77,63.18 64.77,68.9 63.82,69.85 62.23,69.85 62.23,71.44 63.18,72.39 64.77,72.39 64.77,76.52 63.82,77.47 61.59,77.47 v61.59,88.9 | v51.75,93.03 51.75,103.19 52.07,103.5 52.07,104.78 51.44,105.41 49.53,105.41 49.53,120.65 BX2.12
  Bottom 0.406: v61.59,88.9 57.47,93.03 v51.75,93.03
BH1J  (via drill 0.81)
  Top 0.406: v73.66,76.83 74.93,78.11 v74.93,102.23
  Bottom 0.406: IC4.8 71.75,76.83 v73.66,76.83 | v74.93,102.23 50.16,102.23 BX1.14
BH2J  (via drill 0.81)
  Top 0.406: IC4.21 60.64,76.2 60.64,88.27 60.33,88.58 60.33,101.6 62.23,103.5 v62.23,115.57
  Bottom 0.406: v62.23,115.57 57.15,120.65 49.53,120.65 BX2.14
BJ1J  (via drill 0.81)
  Top 0.406: v73.66,75.25 75.88,77.47 75.88,100.65 v76.2,100.97
  Bottom 0.406: IC4.7 72.71,75.25 v73.66,75.25 | v76.2,100.97 48.9,100.97 BX1.16
BJ2J  (via drill 0.81)
  Top 0.406: IC4.22 60.64,73.66 60.64,74.93 59.37,76.2 59.37,103.19 59.69,103.5 v59.69,115.57
  Bottom 0.406: v59.69,115.57 58.1,117.16 50.48,117.16 BX2.16
BK1J  (via drill 0.81)
  Top 0.406: v45.09,74.61 43.18,76.52 BX1.18
  Bottom 0.406: IC4.6 70.8,71.44 64.77,71.44 63.82,72.39 47.31,72.39 v45.09,74.61
BK2J  (via drill 0.81)
  Top 0.406: IC4.23 66.67,71.12 v66.67,110.81
  Bottom 0.406: v66.67,110.81 63.18,114.3 50.8,114.3 BX2.18
BL1J  (via drill 0.81)
  Top 0.406: v84.45,68.58 85.72,67.31 87.31,67.31 87.31,67.94 87.63,68.26 87.63,71.44 86.68,72.39 85.09,72.39 85.09,105.09 v85.41,105.41
  Bottom 0.406: v84.45,68.58 IC4.5 | v85.41,105.41 82.87,107.95 67.94,107.95 66.04,109.86 36.83,109.86 34.29,107.31 34.29,102.87 39.37,102.87 BX1.20
BL2J
  Bottom 0.406: IC4.24 63.82,68.26 65.09,68.26 69.85,63.5 69.85,62.23 71.44,62.23 72.39,61.28 72.39,54.29 45.09,54.29 44.77,54.61 15.88,54.61 13.34,57.15 9.53,57.15 8.89,57.78 8.89,62.23 10.79,62.23 11.43,62.87 11.43,64.14 12.06,64.77 13.34,64.77 13.97,65.41 13.97,67.31 9.53,67.31 5.08,71.75 5.08,125.73 38.73,125.73 39.37,125.09 39.37,121.92 BX2.20
BM1J  (via drill 0.81)
  Top 0.406: IC4.4 69.53,67.63 v69.53,103.5
  Bottom 0.406: v69.53,103.5 65.09,107.95 40.01,107.95 39.37,107.31 39.37,104.14 BX1.22
BM2J  (via drill 0.81)
  Top 0.406: v55.88,66.04 55.24,66.67 55.24,102.87 54.61,103.5 54.61,104.78 53.98,105.41 52.7,105.41 52.07,106.05 v52.07,111.12
  Bottom 0.406: v55.88,66.04 IC4.25 | v52.07,111.12 42.55,120.65 39.37,120.65 BX2.22
BN1J  (via drill 0.81)
  Top 0.406: IC4.3 72.39,64.77 72.39,102.23 v67.94,106.68
  Bottom 0.406: v67.94,106.68 65.72,108.9 38.42,108.9 36.83,107.31 36.83,104.14 BX1.24
BN2J  (via drill 0.81)
  Top 0.406: v32.38,67.31 29.21,70.48 29.21,115.89 28.89,116.2 28.89,117.47 v29.21,117.79
  Bottom 0.406: IC4.26 62.23,64.77 54.61,64.77 52.07,67.31 v32.38,67.31 | v29.21,117.79 28.26,118.75 26.67,118.75 24.13,121.28 24.13,123.19 34.29,123.19 BX2.24
BP1J  (via drill 0.81)
  Top 0.406: v42.55,69.85 34.61,69.85 34.61,101.92 33.02,103.5 BX1.26
  Bottom 0.406: IC4.2 70.8,61.28 69.53,61.28 64.77,66.04 64.77,67.31 53.34,67.31 50.8,69.85 v42.55,69.85
BP2J  (via drill 0.81)
  Top 0.406: IC4.27 61.28,63.18 61.28,71.75 v59.37,73.66 | v21.27,77.47 20,78.74 20,99.38 24.13,103.5 v24.13,110.17 | v32.7,113.98 33.02,114.3 BX2.26
  Bottom 0.406: v59.37,73.66 55.56,77.47 47.62,77.47 46.35,78.74 42.23,78.74 40.96,77.47 v21.27,77.47 | v24.13,110.17 27.94,113.98 v32.7,113.98
BR1J  (via drill 0.81)
  Top 0.406: v33.97,60.96 33.66,61.28 33.66,100.97 BX1.28
  Bottom 0.406: IC4.1 67.94,55.24 47.94,55.24 47.62,55.56 39.37,55.56 v33.97,60.96
BR2J  (via drill 0.81)
  Top 0.406: IC4.28 58.74,53.66 v58.74,49.53 | v31.11,49.53 24.13,56.52 24.13,83.82 26.67,86.36 26.67,116.2 27.94,117.47 27.94,119.38 BX2.28
  Bottom 0.406: v31.11,49.53 v58.74,49.53
BS1J  (via drill 0.81)
  Top 0.406: IC5.8 44.77,76.2 44.77,98.42 v45.09,98.74
  Bottom 0.406: v45.09,98.74 41.91,101.92 30.16,101.92 BX1.30
BS2J  (via drill 0.81)
  Top 0.406: IC5.21 36.83,80.01 v36.83,116.52
  Bottom 0.406: v36.83,116.52 32.7,120.65 29.21,120.65 BX2.30
BT2J  (via drill 0.81)
  Top 0.406: IC5.22 35.56,78.74 35.56,102.23 34.29,103.5 v34.29,116.52
  Bottom 0.406: v34.29,116.52 31.11,119.7 27.62,119.7 BX2.32
BU1J  (via drill 0.81)
  Top 0.406: v21.59,73.66 19.05,76.2 19.05,100.33 BX1.34
  Bottom 0.406: IC5.6 47.94,71.44 41.91,71.44 40.96,72.39 25.08,72.39 23.81,73.66 v21.59,73.66
BU2J  (via drill 0.81)
  Top 0.406: IC5.23 41.91,72.39 v41.91,111.12
  Bottom 0.406: v41.91,111.12 37.78,115.25 25.72,115.25 22.23,118.75 22.23,121.92 BX2.34
BV1J  (via drill 0.81)
  Top 0.406: v21.59,72.07 18.1,75.56 18.1,101.92 BX1.36
  Bottom 0.406: IC5.5 42.23,68.58 40.96,69.85 26.35,69.85 24.13,72.07 v21.59,72.07
BV2J
  Bottom 0.406: IC5.24 40.32,68.9 26.04,68.9 25.08,69.85 8.26,69.85 6.03,72.07 6.03,121.92 BX2.36
CLK  (via drill 0.81)
  Top 0.406: v53.02,87.63 v53.02,64.77
  Bottom 0.406: IC1.12 138.43,85.09 118.43,85.09 117.16,86.36 IC2.12 116.52,86.36 115.25,85.09 103.5,85.09 102.55,86.04 94.3,86.04 IC3.12 93.66,86.04 87.63,86.04 86.68,85.09 72.71,85.09 71.44,86.36 IC4.12 69.85,87.63 v53.02,87.63 49.53,87.63 IC5.12 | PC1.7 39.05,63.5 40.32,64.77 v53.02,64.77
CS-N  (via drill 0.81)
  Top 0.406: v51.12,62.23 51.75,62.87 v51.75,82.55
  Bottom 0.406: IC1.11 133.67,83.82 132.4,82.55 118.11,82.55 IC2.11 115.57,82.55 102.55,82.55 101.28,83.82 IC3.11 92.71,82.55 69.85,82.55 | IC5.11 49.53,82.55 v51.75,82.55 69.85,82.55 | IC4.11 69.85,82.55 | PC1.5 13.97,62.23 v51.12,62.23
GND  (via drill 0.81)
  Top 0.813: IC5.10 46.04,83.5 v46.04,91.44 | v30.48,99.38 IC6.7 | GND.8 v73.66,81.28 | GND.8 GND.7 GND.6 GND.5 GND.4 GND.3 GND.2 GND.1 | IC3.25 88.9,66.04 88.9,75.56 93.98,80.64 IC3.10 | v101.6,81.92 AX1.32 | R12.1 R13.1 13.02,50.8 | 13.02,50.8 8.57,55.24 8.57,64.45 PC1.10 10.16,66.36 7.94,68.58 7.94,112.71 10.16,114.94 POWER.2 | R14.1 36.51,50.8 | 36.51,50.8 C2.2 | IC5.7 44.45,69.85 44.45,40.64 42.86,39.05 36.51,39.05 36.51,50.8 | C3.2 v78.74,58.42 78.74,72.39 77.47,73.66 77.47,103.5 73.98,103.5 GND.8 | GNDL2.1 R4.1 | GNDL1.1 R3.1 | GNDL0.1 R2.1 | C6.2 C5.2 | C5.2 118.11,57.15 IC2.1 116.84,58.74 121.92,63.82 C7.2 | v137.16,63.5 v137.16,78.74 | GNDL3.1 R5.1 109.22,13.02 116.84,20.64 R11.1 | R10.1 R11.1 | C5.2 118.11,50.48 116.52,48.9 116.52,22.86 R11.1 | UUT.NC@3 10.79,48.26 13.02,50.48 13.02,50.8
  Bottom 0.813: v46.04,91.44 44.45,93.03 32.07,93.03 IC6.7 | POWER.2 10.16,114.94 18.1,114.94 18.1,104.14 19.68,102.55 23.81,102.55 BX1.32 25.72,104.14 v30.48,99.38 | v73.66,81.28 IC4.10 | BX2.6 60.96,119.38 GND.2 | v101.6,81.92 94.61,81.92 IC3.10 | C3.2 C4.2 R14.1 | C2.2 R12.1 | v78.74,58.42 IC3.25 | UUT.NC@2 UUT.NC@1 | UUT.NC@3 UUT.NC@4 UUT.NC@2 | UUT.NC@5 UUT.NC@6 UUT.NC@7 29.53,11.75 29.84,11.75 UUT.NC@8 29.84,14.92 40.01,25.08 43.5,25.08 C1.- | UUT.NC@2 13.97,5.71 UUT.NC@5 | 49.69,6.51 55.88,12.7 R2.1 R3.1 R4.1 R5.1 | 49.69,6.51 GND0.1 | C7.2 IC2.10 | IC2.1 121.92,63.5 IC1.26 v137.16,63.5 | v137.16,78.74 IC1.10 | 141.29,21.27 GNDPROBE.1 | 141.29,21.27 126.05,21.27 R10.1 | AX2.6 137.16,119.38 143.83,119.38 147.64,115.57 147.64,21.59 141.29,21.59 141.29,21.27 | UUT.NC@5 30.16,5.71 31.11,6.67 49.53,6.67 49.69,6.51
  pour Top (isolate 0.406): 152.4,152.4 0,152.4 0,0 152.4,0
  pour Bottom (isolate 0.406): 152.4,152.4 0,152.4 0,0 152.4,0
LED0
  Top 0.406: LED0.1 GREEN.A 55.88,18.1 49.21,24.77 49.21,57.47 IC5.1
LED1  (via drill 0.81)
  Top 0.406: LED1.1 RED1.A 53.98,34.92 53.98,55.24 v51.44,57.78
  Bottom 0.406: v51.44,57.78 IC5.2
LED2
  Top 0.406: YELLOW.A LED2.1 86.36,3.81 70.48,3.81 69.85,4.45 69.85,7.94 50.16,27.62 50.16,61.59 IC5.3
LED3
  Top 0.406: RED2.A LED3.1 101.6,2.86 56.2,2.86 43.81,15.24 43.81,23.5 45.72,25.4 45.72,66.04 IC5.4
N$1
  Top 0.406: ECS.AA1 EDAC.AA1 DEC.AA1 138.43,138.11 138.43,107.95 AX1.1
N$2
  Top 0.406: EDAC.AV1 ECS.AV1
  Bottom 0.406: AX1.35 96.52,107.95 83.82,120.65 EDAC.AV1
N$3
  Top 0.406: ECS.AU1 EDAC.AU1 DEC.AU1
  Bottom 0.406: AX1.33 87.31,118.43 87.31,138.75 DEC.AU1
N$4  (via drill 0.81)
  Top 0.406: v90.17,118.11 EDAC.AT1 ECS.AT1
  Bottom 0.406: v90.17,118.11 AX1.31
N$5  (via drill 0.81)
  Top 0.406: ECS.AS1 EDAC.AS1 DEC.AS1 v93.34,117.47
  Bottom 0.406: v93.34,117.47 AX1.29
N$6  (via drill 0.81)
  Top 0.406: v95.25,118.11 95.25,139.06 EDAC.AR1 ECS.AR1
  Bottom 0.406: v95.25,118.11 AX1.27
N$7  (via drill 0.81)
  Top 0.406: ECS.AP1 EDAC.AP1 DEC.AP1 100.33,138.11 100.33,116.84 v99.69,116.2
  Bottom 0.406: v99.69,116.2 AX1.25
N$8
  Top 0.406: EDAC.AN1 ECS.AN1
  Bottom 0.406: AX1.23 111.76,113.35 107.63,113.35 102.87,118.11 102.87,123.19 109.86,123.19 110.49,123.83 110.49,128.27 102.87,135.89 EDAC.AN1
N$9  (via drill 0.81)
  Top 0.406: ECS.AM1 EDAC.AM1 DEC.AM1 107.95,136.84 v107.95,114.62
  Bottom 0.406: AX1.21 114.3,114.62 v107.95,114.62
N$10  (via drill 0.81)
  Top 0.406: v111.76,116.84 110.49,118.11 110.49,137.48 109.22,138.75 EDAC.AL1 ECS.AL1
  Bottom 0.406: AX1.19 116.84,115.57 113.03,115.57 v111.76,116.84
N$11  (via drill 0.81)
  Top 0.406: ECS.AK1 EDAC.AK1 DEC.AK1 112.39,131.44 115.57,128.27 115.57,118.11 v116.84,116.84
  Bottom 0.406: AX1.17 119.38,116.84 v116.84,116.84
N$12
  Top 0.406: AX1.15 121.6,107 121.6,120.33 120.65,121.28 120.65,122.56 120.02,123.19 118.11,123.19 118.11,127 115.57,129.54 EDAC.AJ1 ECS.AJ1
N$13  (via drill 0.81)
  Top 0.406: ECS.AH1 EDAC.AH1 DEC.AH1 | AX1.13 124.78,107 124.78,119.38 v125.73,120.33
  Bottom 0.406: v125.73,120.33 125.73,137.16 120.33,137.16 DEC.AH1
N$14  (via drill 0.81)
  Top 0.406: v123.19,110.49 123.19,127 121.92,128.27 EDAC.AF1 ECS.AF1
  Bottom 0.406: v123.19,110.49 AX1.11
N$15
  Top 0.406: ECS.AE1 EDAC.AE1 DEC.AE1 128.27,135.57 128.27,121.28 129.54,120.02 AX1.9
N$16
  Top 0.406: AX1.7 133.35,107.95 133.35,139.7 133.03,140.02 133.03,147 130.18,149.86 126.68,149.86 126.68,144.78 128.27,143.19 ECS.AD1 EDAC.AD1
N$17  (via drill 0.81)
  Top 0.406: DEC.AC1 EDAC.AC1 ECS.AC1 | v134.62,119.7 AX1.5
  Bottom 0.406: v134.62,119.7 133.35,120.97 133.35,133.67 133.03,133.67 126.68,140.02 126.68,143.51 129.86,143.51 ECS.AC1
N$18
  Top 0.406: AX1.3 137.16,120.02 135.89,121.28 135.89,137.48 134.62,138.75 EDAC.AB1 ECS.AB1
N$19
  Top 0.406: ECS.AA2 EDAC.AA2
  Bottom 0.406: AX2.1 139.7,145.1 ECS.AA2
N$20
  Top 0.406: DEC.AB2 EDAC.AB2 ECS.AB2 136.21,143.51 136.21,138.43 136.84,137.79 136.84,124.78 AX2.3
N$21
  Top 0.406: ECS.AC2 EDAC.AC2
  Bottom 0.406: AX2.5 134.62,138.75 134.3,138.75 133.03,140.02 133.03,145.1 ECS.AC2
N$22
  Top 0.406: DEC.AD2 EDAC.AD2 ECS.AD2 129.86,143.51 129.86,138.43 130.18,138.11 130.18,126.36 AX2.7
N$23
  Top 0.406: AX2.9 129.22,124.78 129.22,137.48 126.68,140.02 126.68,143.51 ECS.AE2 EDAC.AE2
N$24
  Top 0.406: DEC.AF2 EDAC.AF2 ECS.AF2 123.51,143.51 123.51,127.95 AX2.11
N$25
  Top 0.406: ECS.AH2 EDAC.AH2
  Bottom 0.406: AX2.13 116.52,132.4 116.52,139.38 117.16,140.02 117.16,145.1 ECS.AH2
N$26
  Top 0.406: DEC.AJ2 EDAC.AJ2 ECS.AJ2 117.16,143.51 117.16,129.22 AX2.15
N$27
  Top 0.406: ECS.AK2 EDAC.AK2
  Bottom 0.406: AX2.17 119.38,128.27 113.98,133.67 113.98,145.1 ECS.AK2
N$28
  Top 0.406: DEC.AL2 EDAC.AL2 ECS.AL2
  Bottom 0.406: AX2.19 116.84,125.73 110.81,131.76 110.81,145.1 ECS.AL2
N$29
  Top 0.406: ECS.AM2 EDAC.AM2
  Bottom 0.406: AX2.21 114.3,125.73 107.63,132.4 107.63,145.1 ECS.AM2
N$30
  Top 0.406: DEC.AN2 EDAC.AN2 ECS.AN2 104.46,143.51 109.54,143.51 110.81,142.24 110.81,138.43 111.44,137.79 111.44,124.78 AX2.23
N$31
  Top 0.406: ECS.AP2 EDAC.AP2
  Bottom 0.406: AX2.25 109.22,127.95 101.28,135.89 101.28,145.1 ECS.AP2
N$32
  Top 0.406: DEC.AR2 EDAC.AR2 ECS.AR2 98.11,143.51 103.19,143.51 104.46,142.24 104.46,126.68 AX2.27
N$33
  Top 0.406: ECS.AS2 EDAC.AS2
  Bottom 0.406: AX2.29 104.14,130.18 94.93,139.38 94.93,145.1 ECS.AS2
N$34
  Top 0.406: DEC.AT2 EDAC.AT2 ECS.AT2
  Bottom 0.406: AX2.31 91.76,134.3 91.76,145.1 ECS.AT2
N$35
  Top 0.406: ECS.AU2 EDAC.AU2
  Bottom 0.406: AX2.33 88.58,134.94 88.58,145.1 ECS.AU2
N$36
  Top 0.406: DEC.AV2 EDAC.AV2 ECS.AV2 83.82,143.51 96.84,143.51 98.11,142.24 98.11,126.05 AX2.35
N$37
  Top 0.406: ECS.BA2 EDAC.BA2
  Bottom 0.406: BX2.1 65.41,126.36 70.17,126.36 71.12,127.32 71.12,145.1 ECS.BA2
N$38
  Top 0.406: DEC.BB2 EDAC.BB2 ECS.BB2 63.18,143.51 63.18,126.68 BX2.3
N$39
  Top 0.406: BX2.5 58.74,124.78 58.74,137.79 60.01,139.06 60.01,143.51 ECS.BC2 EDAC.BC2
N$40
  Top 0.406: DEC.BD2 EDAC.BD2 ECS.BD2 56.83,143.51 56.83,138.43 56.2,137.79 56.2,124.78 BX2.7
N$41
  Top 0.406: BX2.9 53.66,124.78 53.66,143.51 ECS.BE2 EDAC.BE2
N$42
  Top 0.406: DEC.BF2 EDAC.BF2 ECS.BF2
  Bottom 0.406: BX2.11 50.8,139.7 50.48,140.02 50.48,145.1 ECS.BF2
N$43
  Top 0.406: BX2.13 50.48,126.68 50.48,143.51 ECS.BH2 EDAC.BH2
N$44
  Top 0.406: DEC.BJ2 EDAC.BJ2 ECS.BJ2 47.31,143.51 47.31,139.06 46.04,137.79 46.04,124.78 BX2.15
N$45
  Top 0.406: BX2.17 43.5,124.78 43.5,137.79 44.13,138.43 44.13,143.51 ECS.BK2 EDAC.BK2
N$46
  Top 0.406: DEC.BL2 EDAC.BL2 ECS.BL2 40.96,143.51 40.96,124.78 BX2.19
N$47
  Top 0.406: BX2.21 37.78,124.78 37.78,143.51 ECS.BM2 EDAC.BM2
N$48
  Top 0.406: DEC.BN2 EDAC.BN2 ECS.BN2 34.61,143.51 34.61,138.43 35.24,137.79 35.24,124.78 BX2.23
N$49
  Top 0.406: BX2.25 32.7,124.78 32.7,137.79 31.43,139.06 31.43,143.51 ECS.BP2 EDAC.BP2
N$50
  Top 0.406: DEC.BR2 EDAC.BR2 ECS.BR2 28.26,143.51 28.26,138.43 30.16,136.53 30.16,124.78 BX2.27
N$51
  Top 0.406: BX2.29 25.72,126.68 25.72,139.38 25.08,140.02 25.08,143.51 ECS.BS2 EDAC.BS2
N$52  (via drill 0.81)
  Top 0.406: DEC.BT2 EDAC.BT2 ECS.BT2 | BX2.31 24.45,125.41 v24.45,135.89
  Bottom 0.406: v24.45,135.89 21.91,138.43 21.91,145.1 ECS.BT2
N$53  (via drill 0.81)
  Top 0.406: v22.86,135.89 BX2.33 | ECS.BU2 EDAC.BU2
  Bottom 0.406: v22.86,135.89 18.73,140.02 18.73,145.1 ECS.BU2
N$54  (via drill 0.81)
  Top 0.406: DEC.BV2 EDAC.BV2 ECS.BV2 | BX2.35 20,124.78 v20,133.99
  Bottom 0.406: v20,133.99 15.56,138.43 15.56,145.1 ECS.BV2
N$55
  Top 0.406: ECS.BA1 EDAC.BA1 DEC.BA1 67.94,123.19 65.41,120.65 65.41,108.58 BX1.1
N$56
  Top 0.406: BX1.3 60.96,117.47 64.77,121.28 EDAC.BB1 ECS.BB1
N$57
  Top 0.406: ECS.BC1 EDAC.BC1 DEC.BC1 59.69,136.84 59.69,121.28 58.42,120.02 BX1.5
N$58
  Top 0.406: BX1.7 57.15,107.95 57.15,137.48 58.42,138.75 EDAC.BD1 ECS.BD1
N$59
  Top 0.406: ECS.BE1 EDAC.BE1 DEC.BE1 54.61,138.11 54.61,107.95 BX1.9
N$60
  Top 0.406: BX1.11 50.8,120.02 52.07,121.28 EDAC.BF1 ECS.BF1
N$61
  Top 0.406: ECS.BH1 EDAC.BH1 DEC.BH1 46.99,136.84 46.99,107.95 BX1.13
N$62
  Top 0.406: BX1.15 44.45,107.95 44.45,137.48 45.72,138.75 EDAC.BJ1 ECS.BJ1
N$63
  Top 0.406: ECS.BK1 EDAC.BK1 DEC.BK1 41.91,138.11 41.91,121.28 43.18,120.02 BX1.17
N$64
  Top 0.406: BX1.19 39.37,107.95 EDAC.BL1 ECS.BL1
N$65
  Top 0.406: ECS.BM1 EDAC.BM1 DEC.BM1 36.83,138.11 36.83,121.28 38.1,120.02 BX1.21
N$66
  Top 0.406: BX1.23 35.56,120.02 34.29,121.28 34.29,137.48 33.02,138.75 EDAC.BN1 ECS.BN1
N$67
  Top 0.406: ECS.BP1 EDAC.BP1 DEC.BP1 31.75,136.84 31.75,121.28 31.43,120.97 31.43,108.27 BX1.25
N$68  (via drill 0.81)
  Top 0.406: BX1.27 30.16,107 v30.16,116.52 | v26.35,117.47 26.67,117.79 26.67,122.56 27.3,123.19 29.21,123.19 29.21,136.21 26.67,138.75 EDAC.BR1 ECS.BR1
  Bottom 0.406: v30.16,116.52 27.3,116.52 v26.35,117.47
N$69  (via drill 0.81)
  Top 0.406: DEC.BS1 EDAC.BS1 ECS.BS1 23.5,143.51 20,143.51 18.73,142.24 18.73,113.03 v22.86,108.9
  Bottom 0.406: BX1.29 25.72,108.9 v22.86,108.9
N$70
  Top 0.406: BX1.31 25.4,115.57 21.59,119.38 21.59,139.06 EDAC.BT1 ECS.BT1
N$71
  Top 0.406: ECS.BU1 EDAC.BU1 DEC.BU1 17.14,112.39 BX1.33
N$72
  Top 0.406: BX1.35 14.92,112.08 14.92,139.38 EDAC.BV1 ECS.BV1
N$73
  Bottom 0.406: GREEN.K 58.42,22.86 R2.2
N$74
  Bottom 0.406: RED1.K 73.66,22.86 R3.2
N$75
  Bottom 0.406: YELLOW.K 88.9,22.86 R4.2
N$76
  Bottom 0.406: RED2.K 104.14,22.86 R5.2
N$77
  Top 0.406: R7.1 R6.1 LOADL3.1
N$78
  Top 0.406: R9.1 R8.1 LOADL1.1
N$79
  Top 0.406: LOADHI1.1 R11.2
N$80
  Top 0.406: LOADHI3.1 R10.2
N$81
  Top 0.406: D2.A D1.C
N$82
  Top 0.406: UUT_PWR.K 17.78,25.4 R13.2 R12.2
N$83
  Bottom 0.406: PWR.K 35.56,40.64 R14.2
PROBE1  (via drill 0.81)
  Top 0.406: IC5.25 39.37,64.77 39.37,52.39 41.91,49.85 v41.91,40.32
  Bottom 0.406: v41.91,40.32 54.29,27.94 142.24,27.94 PROBE1.1
PROBE2  (via drill 0.81)
  Top 0.406: IC5.26 43.18,60.96 v43.18,41.27
  Bottom 0.406: v43.18,41.27 51.44,33.02 PROBE2.1
PROBE3  (via drill 0.81)
  Top 0.406: v38.1,58.42 38.42,58.1 38.42,52.07 40.64,49.85 v40.64,44.45
  Bottom 0.406: v38.1,58.42 IC5.27 | v40.64,44.45 42.55,42.55 142.88,42.55 PROBE3.1
PROBE4  (via drill 0.81)
  Top 0.406: v76.83,44.45 v64.77,56.52
  Bottom 0.406: IC5.28 42.55,56.52 v64.77,56.52 | v76.83,44.45 140.97,44.45 PROBE4.1
RESET-N  (via drill 0.81)
  Top 0.406: IC1.18 IC1.17 IC1.16 IC1.15 | IC2.18 IC2.17 IC2.16 IC2.15 | IC3.18 IC3.17 IC3.16 IC3.15 | IC4.18 IC4.17 IC4.16 IC4.15 | IC5.15 IC5.16 IC5.17 IC5.18 | v25.4,58.42 26.35,59.37 v26.35,78.74
  Bottom 0.406: v25.4,58.42 PC1.3 | v26.35,78.74 30.16,82.55 39.37,82.55 IC5.18 | 62.23,85.09 IC4.18 | 62.23,85.09 41.91,85.09 IC5.17 | 62.23,85.09 71.44,85.09 72.39,84.14 86.04,84.14 IC3.18 86.68,83.82 87.95,85.09 101.28,85.09 102.23,84.14 108.9,84.14 IC2.18 115.25,83.82 116.52,85.09 117.16,85.09 118.11,84.14 131.76,84.14 IC1.18
SI-A
  Bottom 0.406: IC1.13 140.02,88.58 141.29,88.58 141.92,87.95 141.92,59.69 134.94,59.69 122.24,46.99 28.57,46.99 26.04,49.53 14.61,49.53 7.94,56.2 7.94,64.77 10.79,64.77 12.06,66.04 PC1.9
SI-B  (via drill 0.81)
  Top 0.406: v103.82,86.36 102.87,85.41 v102.87,65.72 | v33.97,48.26 28.89,53.34 v28.89,64.77
  Bottom 0.406: IC2.13 115.57,87.63 107.63,87.63 106.36,86.36 v103.82,86.36 | v102.87,65.72 85.41,48.26 v33.97,48.26 | v28.89,64.77 25.08,68.58 PC1.11
SI-C
  Bottom 0.406: IC3.13 85.41,97.47 33.02,97.47 32.7,97.79 17.14,97.79 6.99,87.63 6.99,72.39 11.43,72.39 PC1.13
SI-D
  Bottom 0.406: IC4.13 72.39,90.17 72.39,95.25 15.88,95.25 7.94,87.31 7.94,74.93 11.43,74.93 PC1.15
SI-E  (via drill 0.81)
  Top 0.406: IC5.13 49.53,87.63 49.53,78.42 48.58,77.47 v46.04,77.47
  Bottom 0.406: v46.04,77.47 43.5,74.93 13.97,74.93 PC1.17
SO-A  (via drill 0.81)
  Top 0.406: IC6.1 32.38,78.11 v32.38,96.52
  Bottom 0.406: v32.38,96.52 32.7,96.2 73.98,96.2 82.55,87.63 106.36,87.63 108.9,90.17 129.22,90.17 132.08,93.03 138.11,93.03 IC1.14
SO-AN  (via drill 0.81)
  Top 0.406: v27.94,78.74 27.62,78.42 v27.62,60.96
  Bottom 0.406: v27.94,78.74 IC6.2 | v27.62,60.96 26.35,59.69 11.43,59.69 PC1.4
SO-B  (via drill 0.81)
  Top 0.406: v88.9,81.28 90.81,83.19 v90.81,93.66
  Bottom 0.406: IC6.3 31.75,80.01 87.63,80.01 v88.9,81.28 | v90.81,93.66 91.76,92.71 115.57,92.71 IC2.14
SO-BN
  Bottom 0.406: IC6.4 29.21,85.09 13.97,85.09 PC1.25
SO-C  (via drill 0.81)
  Top 0.406: v52.7,90.17 53.02,90.49 v53.02,98.74 | v93.34,99.38 93.98,98.74 IC3.14
  Bottom 0.406: IC6.5 31.75,87.63 45.4,87.63 47.94,90.17 v52.7,90.17 | v53.02,98.74 54.29,100.01 75.56,100.01 76.2,99.38 v93.34,99.38
SO-CN
  Bottom 0.406: IC6.6 29.21,87.63 12.06,87.63 11.43,87 11.43,83.82 PC1.23
SO-D
  Bottom 0.406: IC6.9 28.26,94.3 68.26,94.3 IC4.14
SO-DN
  Bottom 0.406: IC6.8 20,88.58 10.48,88.58 8.89,87 8.89,80.01 11.43,80.01 PC1.19
SO-E  (via drill 0.81)
  Top 0.406: IC6.11 25.4,86.36 v25.4,88.9
  Bottom 0.406: v25.4,88.9 26.67,90.17 46.67,90.17 47.94,91.44 IC5.14
SO-EN  (via drill 0.81)
  Top 0.406: IC6.10 21.27,84.77 v21.27,82.55
  Bottom 0.406: v21.27,82.55 20,81.28 PC1.21
VCC  (via drill 0.81)
  Top 0.813: 22.86,69.22 22.86,48.26 23.97,47.15 | 22.86,69.22 IC6.14 | D1.A 23.97,47.15 | v16.83,104.46 16.83,74.93 22.54,69.22 22.86,69.22 | UUT.2 23.81,12.38 23.81,46.99 23.97,47.15
  Bottom 0.813: v16.83,104.46 10.16,111.12 POWER.3
VDD  (via drill 0.81)
  Top 0.813: C5.1 C6.1 124.46,46.04 127,48.58 C7.1 | v135.89,55.24 v135.89,76.52 | D2.C 30.64,43.02 | 30.64,43.02 PWR.A | C2.1 30.8,43.5 30.8,43.18 30.64,43.02 | v56.52,78.74 56.83,78.42 56.83,66.99 57.47,66.36 57.47,48.9 60.64,45.72 C4.1 | v76.2,76.2 76.2,48.26 C3.1 | IC3.9 90.17,74.93 90.17,54.61 v81.28,45.72
  Bottom 0.813: IC2.9 117.79,79.69 125.41,79.69 C7.1 | IC1.9 137.48,76.52 v135.89,76.52 | v135.89,55.24 126.36,45.72 C6.1 | v56.52,78.74 IC5.9 | IC4.9 71.75,78.11 74.3,78.11 v76.2,76.2 | C2.1 C4.1 C3.1 v81.28,45.72 C5.1
VPP  (via drill 0.81)
  Top 0.813: C1.+ 40.64,14.29 | 40.64,14.29 VPP0.1 | 40.64,14.29 25.08,14.29 25.08,8.89 UUT.3 | VPP.8 VPP.7 VPP.6 VPP.5 VPP.4 VPP.3 VPP.2 | R1.2 v142.24,99.38 142.24,119.38 AX2.2 | R6.2 R7.2
  Bottom 0.813: UUT_PWR.A 24.77,10.79 24.77,8.89 UUT.3 | BX2.2 71.44,121.92 73.03,123.51 79.69,123.51 VPP.1 VPP.2 | VPP.8 84.77,100.65 110.81,100.65 112.08,99.38 v142.24,99.38 | C1.+ 47.31,16.19 115.89,16.19 124.14,24.45 127.95,24.45 R9.2 R8.2 R7.2 | R1.2 146.37,53.34 146.37,24.77 145.41,23.81 140.65,23.81 R6.2

### Text on the board
Top: - | ON
tPlace: BV | BA | AV | AA | M-Series Flip-Chip Tester | Design by Warren Stearns